# Altium project Handheld99.PrjPcb (part 1 of 3)
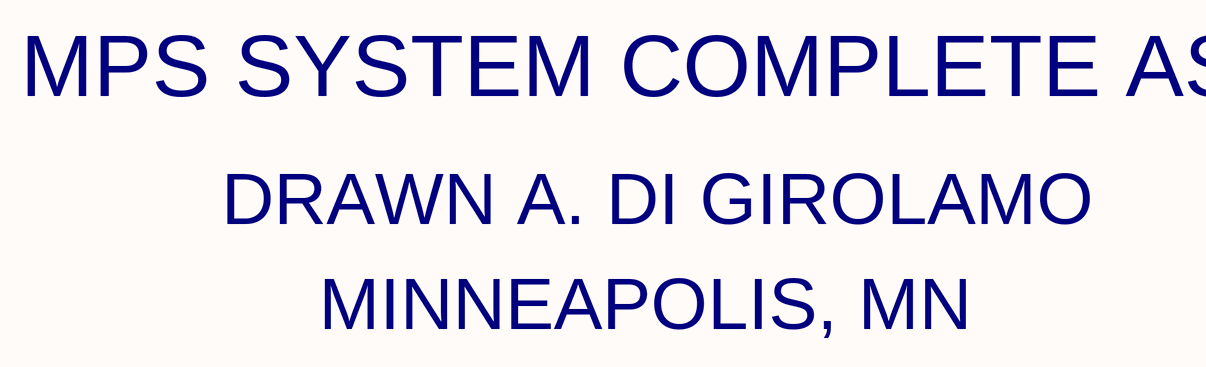
[diagram p0: title_sheet.SchDoc]
37 sheets, 508 parts. Net scope: hierarchical (ports join the sheet entries above them; power ports are global).
Board files: PCB_REAL2.PcbDoc, digital_placeholder.PcbDoc, Radio_batt_testboard.PcbDoc, March_PCBA.PcbDoc, January_PCBA.PcbDoc, January_PCBA _digital.PcbDoc
Sheets:
  title_sheet.SchDoc
  top_level.SchDoc
    MCU = mcu.SchDoc
    BUFF = buffer.SchDoc
    ADC = adc.SchDoc
    dcshift1 = dcshift_digital.SchDoc
    OPA5481 = voltagesource.SchDoc
    MECH = mechanical.SchDoc
    INA = ina.SchDoc
    HP = high_pass.SchDoc
    MIXER1 = mixer.SchDoc
    HP2 = high_pass.SchDoc
    AMP1 = amp.SchDoc
    DC1 = dcshift.SchDoc
    LP2 = LPF_ADC.SchDoc
    MIXER2 = mixer.SchDoc
    dcshift2 = dcshift_digital.SchDoc
    OPA5482 = voltagesource.SchDoc
    LO1 = LO.SchDoc
    LO2 = LO.SchDoc
    uBlox Radio = RADIO.SchDoc
    LO1_INA1 = LOINA.SchDoc
    LO1_INA2 = LOINA.SchDoc
    LO2_INA1 = LOINA.SchDoc
    LO2_INA2 = LOINA.SchDoc
    LP50Driver = 50Hz_GEN_LPF.SchDoc
    LPHFDriver = 5kHz_GEN_LPF.SchDoc
    LP = low_pass.SchDoc
    3v3_Regulator = 3v3_Regulator.SchDoc
    ADC_REF = ADC_Reference.SchDoc
    2v5_Regulator = 2v5_Regulator.SchDoc
    5v_Regulator = 5v_Regulator.SchDoc
    -5v_Regulator = -5v_Regulator.SchDoc
    Power_Input = Power_Input.SchDoc
    AMP2 = amp.SchDoc
    Batt_charger = Batt_Charger.SchDoc
    Large Relay 1 = Large_Relay.SchDoc
    Large Relay 2 = Large_Relay.SchDoc
    Small Relay 1 = Small_Relay.SchDoc
    Small Relay 2 = Small_Relay.SchDoc
    Negative DC-DC = 7419_SUPPLY.SchDoc
    Negative DC-DC = 7419_SUPPLY.SchDoc
    +24 Linear = 24V_Regulator.SchDoc
    5V Linear Digital = 5v_Reg_biggr.SchDoc
    -5V Linear Digital = -5v_Reg_biggr.SchDoc
    Large Relay 3 = Large_Relay.SchDoc
    ZIF_Bridge = ZIF_Bridge.SchDoc
    1v8_Regulator = 1v8_Regulator.SchDoc
    LO1_LPF = 5kHZ_LO_LPF.SchDoc
    LO1_HPF = 5kHZ_LO_LPF.SchDoc
    LO2_LPF = 600Hz_LO_LPF.SchDoc
    LO2_HPF = 5kHZ_LO_LPF.SchDoc

## Sheet title_sheet.SchDoc: TITLE SHEET
size A4; Organization: Altium Limited; Address1: L3, 12a Rodborough Rd; Address2: Frenchs Forest; Address3: NSW; Address4: Australia 2086; DocumentNumber: 1; Revision: 1

### Notes on the sheet
- MPS SYSTEM COMPLETE ASSY
- DRAWN A. DI GIROLAMO
- MINNEAPOLIS, MN
- Title
- Date:
- RE:
- Arturo di Girolamo
- Size:
- A3
- A

## Sheet top_level.SchDoc: TOP LEVEL
size A2; Organization: Altium Limited; Address1: L3, 12a Rodborough Rd; Address2: Frenchs Forest; Address3: NSW; Address4: Australia 2086; DocumentNumber: 1; Revision: 1
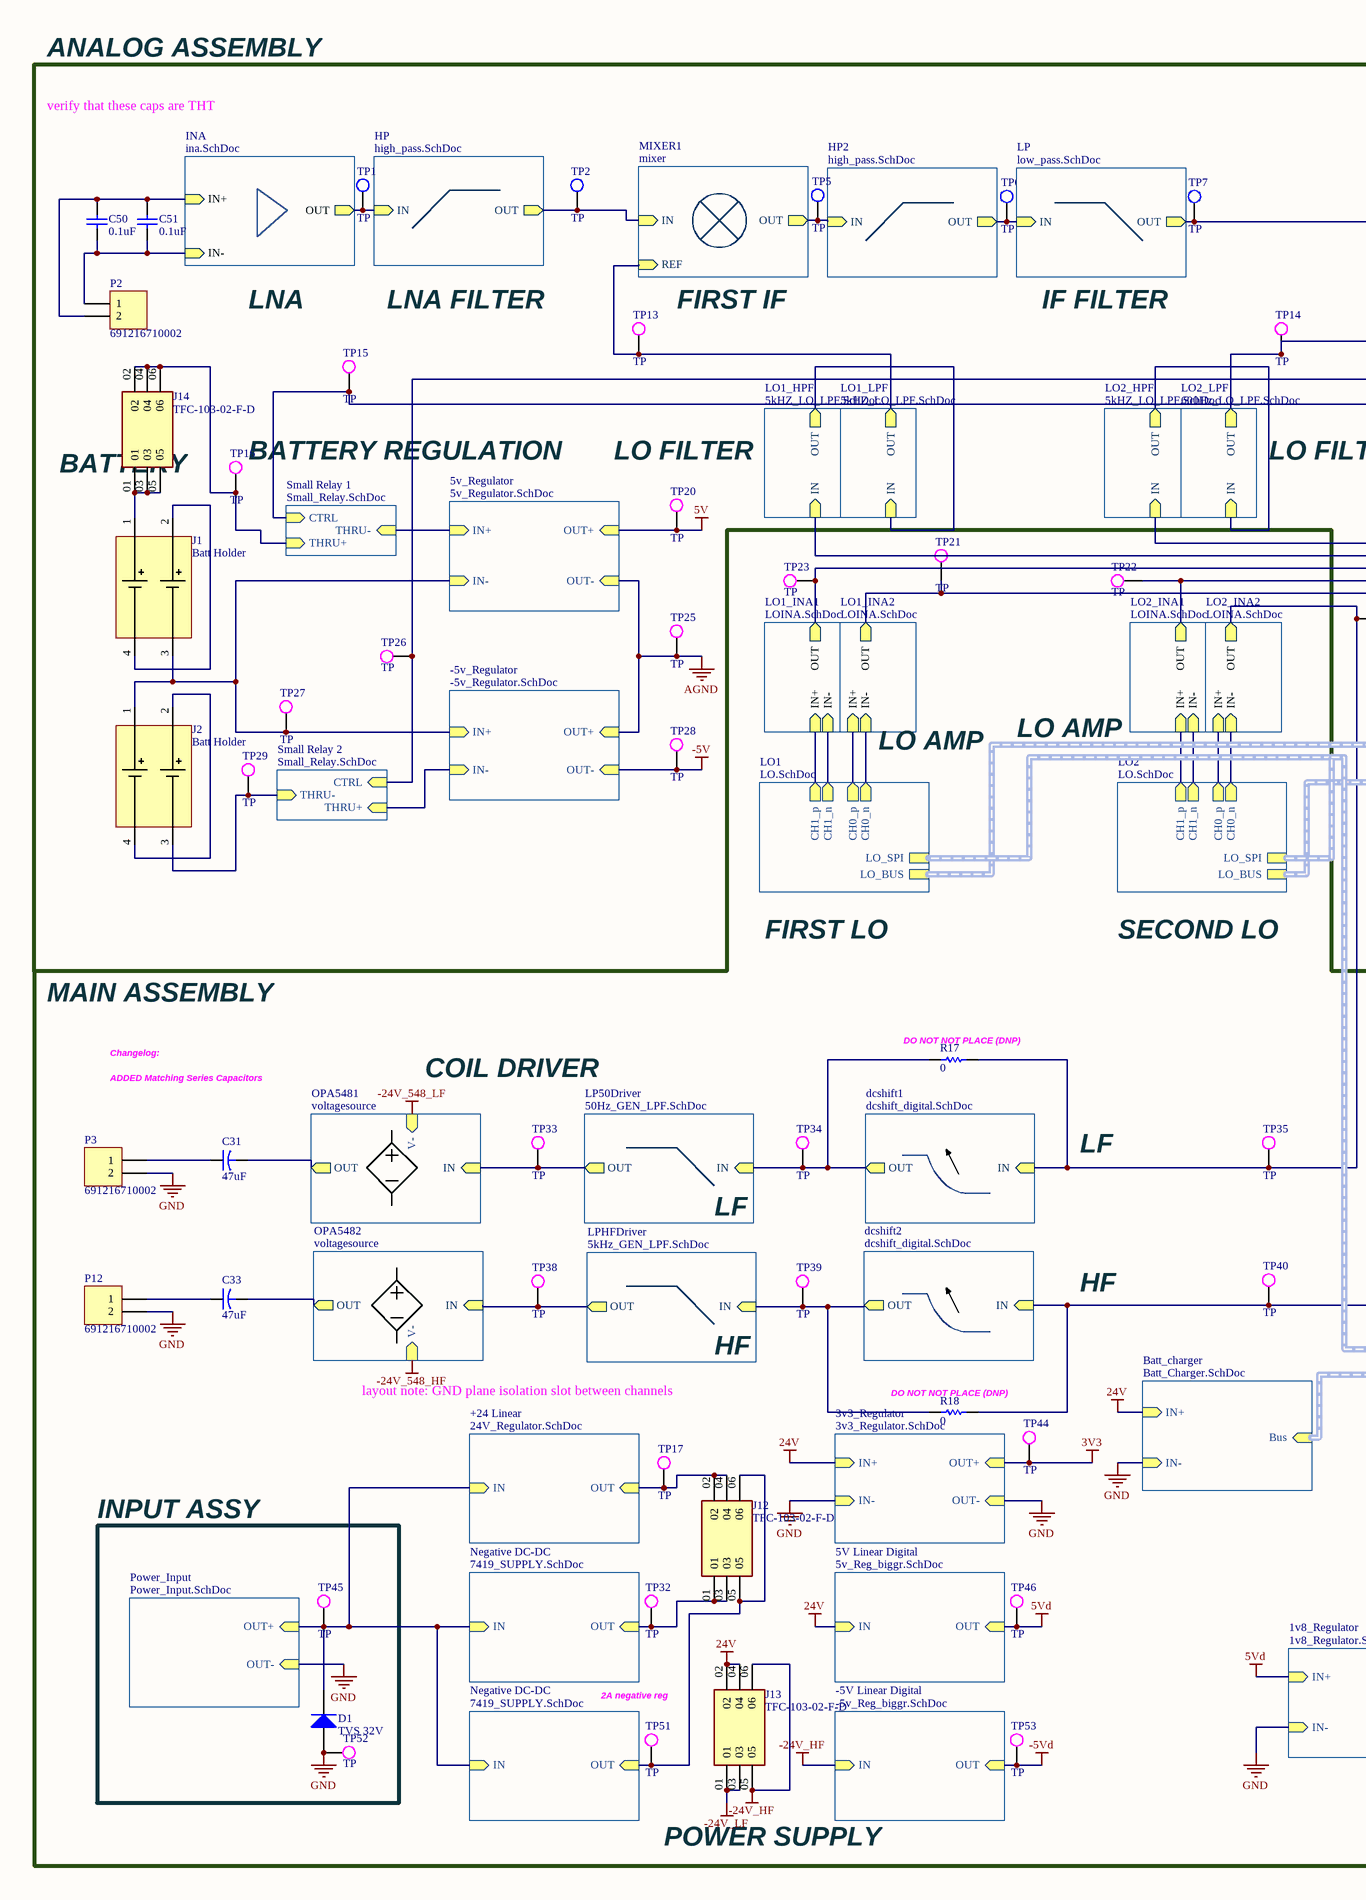
[diagram p1: top_level.SchDoc, left]
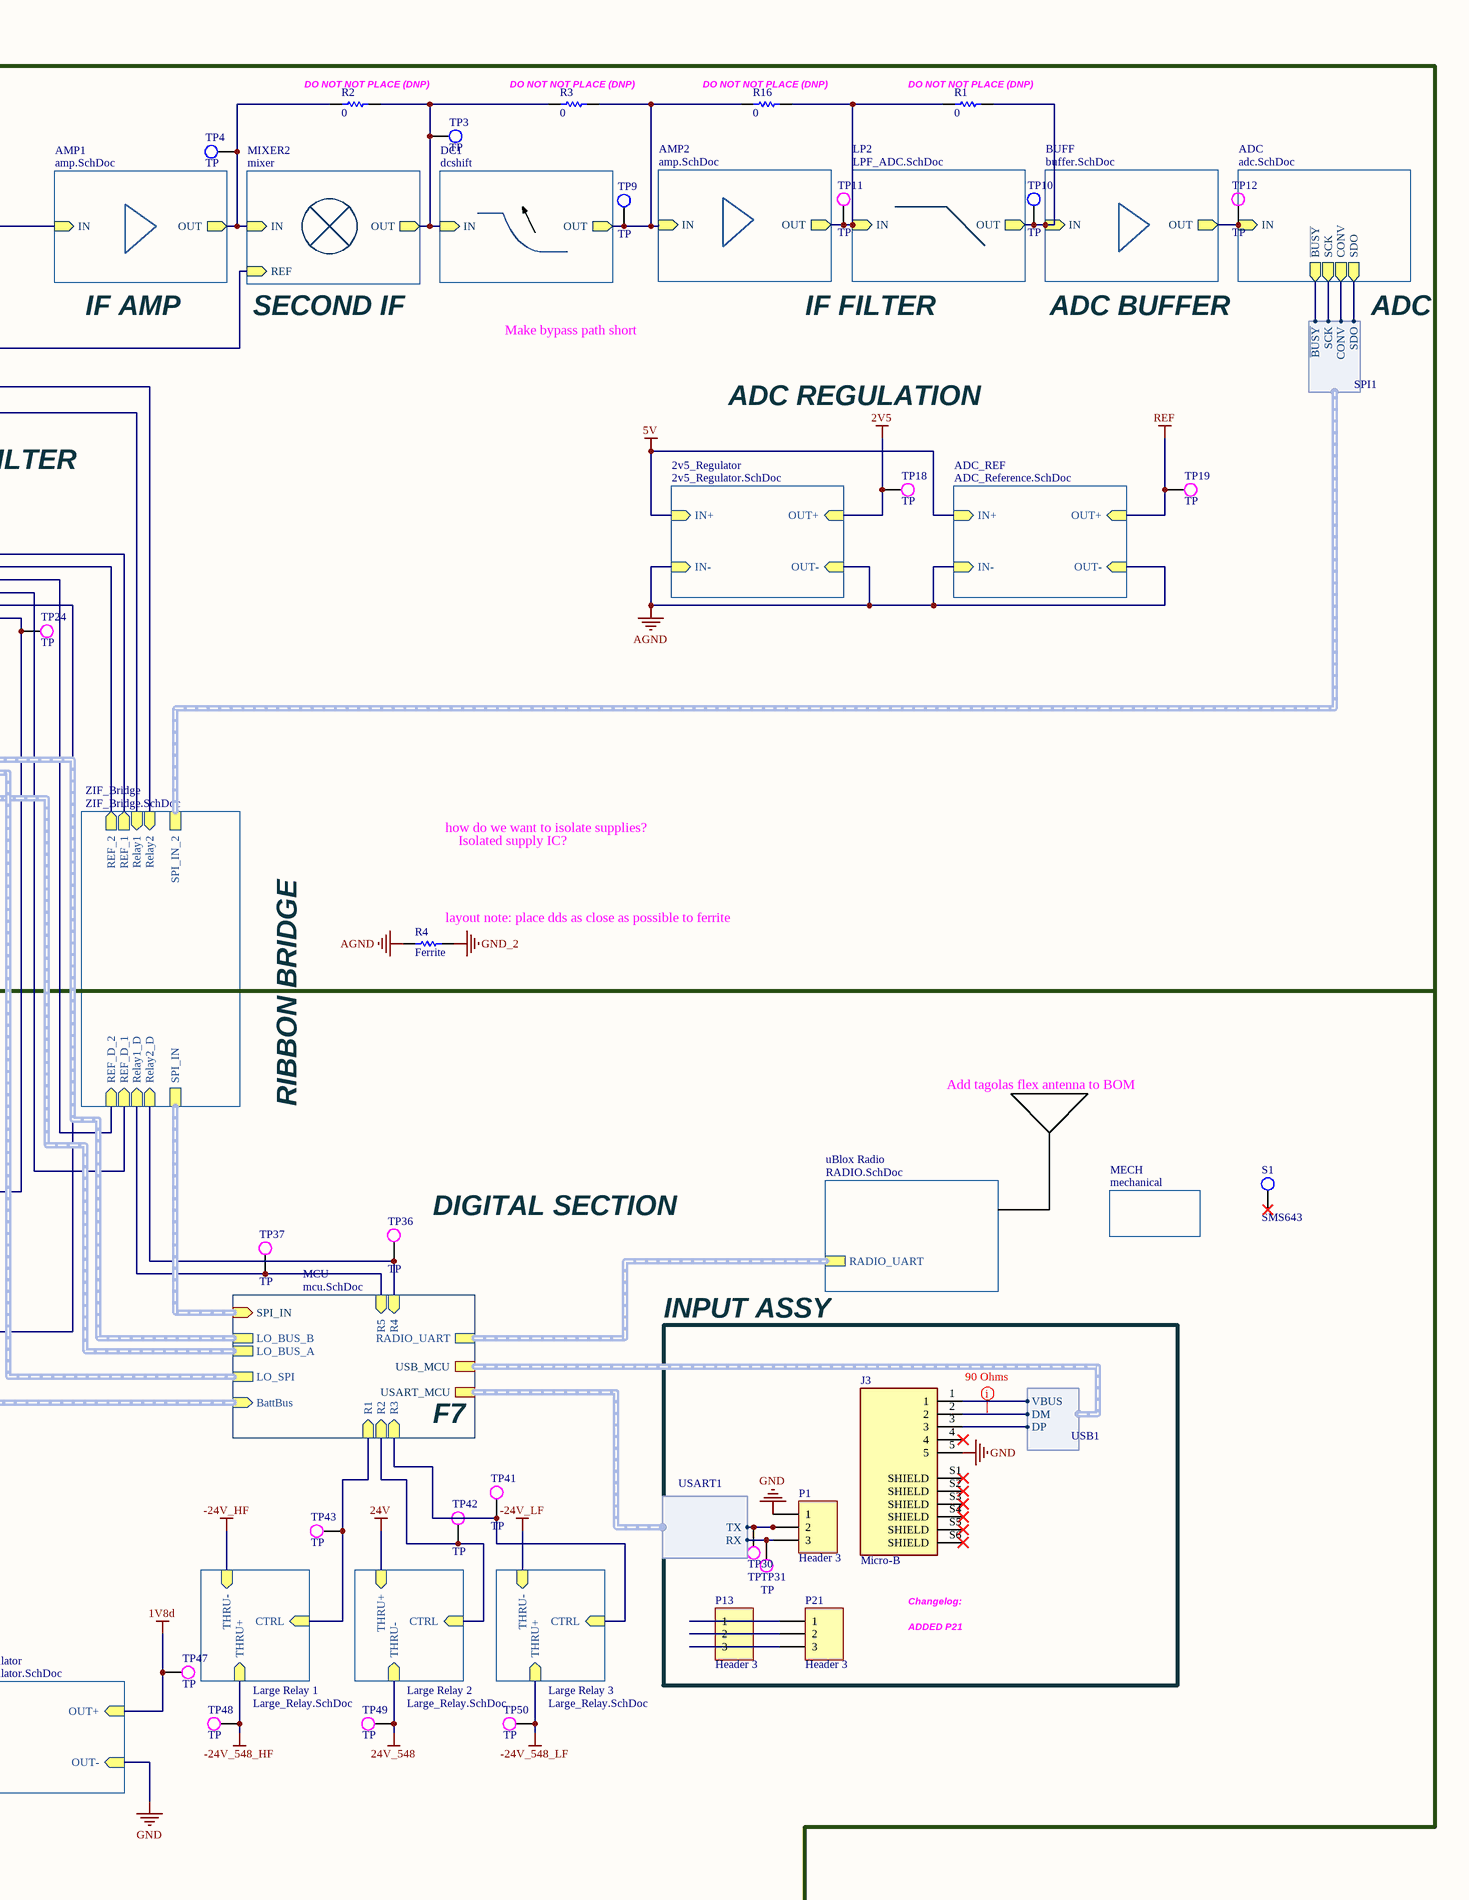
[diagram p2: top_level.SchDoc, right]

### Parts
C31  47uF  [R60xW]
C33  47uF  [10uF_THT_Ceramic]
C50  0.1uF  [STD_0805_C]
C51  0.1uF  [STD_0805_C]
D1  TVS 32V  [TVSDIODE-DO214AA]
J1  Batt Holder  [SMD_Batteryholder]
J2  Batt Holder  [SMD_Batteryholder]
J3  Micro-B  [10118194-0001LF]
J12  TFC-103-02-F-D  [SAMTEC_TFC-103-02-F-D]
J13  TFC-103-02-F-D  [SAMTEC_TFC-103-02-F-D]
J14  TFC-103-02-F-D  [SAMTEC_TFC-103-02-F-D]
P1  Header 3  [HDR1X3]
P2  691216710002  [HDR1X2]
P3  691216710002  [HDR1X2]
P12  691216710002  [HDR1X2]
P13  Header 3  [HDR1X3]
P21  Header 3  [HDR1X3]
R1  0  [0402_Res]
R2  0  [0402_Res]
R3  0  [0402_Res]
R4  Ferrite  [0402_Res]
R16  0  [0402_Res]
R17  0  [0402_Res]
R18  0  [0402_Res]
S1  SMS643  [SMS-463F]
TP1  TP  [Test_point]
TP2  TP  [Test_point]
TP3  TP  [Test_point]
TP4  TP  [Test_point]
TP5  TP  [Test_point]
TP6  TP  [Test_point]
TP7  TP  [Test_point]
TP9  TP  [Test_point]
TP10  TP  [Test_point]
TP11  TP  [Test_point]
TP12  TP  [Test_point]
TP13  TP  [Test_point]
TP14  TP  [Test_point]
TP15  TP  [Test_point]
TP16  TP  [Test_point]
TP17  TP  [Test_point]
TP18  TP  [Test_point]
TP19  TP  [Test_point]
TP20  TP  [Test_point]
TP21  TP  [Test_point]
TP22  TP  [Test_point]
TP23  TP  [Test_point]
TP24  TP  [Test_point]
TP25  TP  [Test_point]
TP26  TP  [Test_point]
TP27  TP  [Test_point]
TP28  TP  [Test_point]
TP29  TP  [Test_point]
TP30  TP  [Test_point]
TP31  TP  [Test_point]
TP32  TP  [Test_point]
TP33  TP  [Test_point]
TP34  TP  [Test_point]
TP35  TP  [Test_point]
TP36  TP  [Test_point]
TP37  TP  [Test_point]
TP38  TP  [Test_point]
TP39  TP  [Test_point]
TP40  TP  [Test_point]
TP41  TP  [Test_point]
TP42  TP  [Test_point]
TP43  TP  [Test_point]
TP44  TP  [Test_point]
TP45  TP  [Test_point]
TP46  TP  [Test_point]
TP47  TP  [Test_point]
TP48  TP  [Test_point]
TP49  TP  [Test_point]
TP50  TP  [Test_point]
TP51  TP  [Test_point]
TP52  TP  [Test_point]
TP53  TP  [Test_point]

### Blocks framed on the sheet
INPUT ASSY: J3 P1 P13 P21 TP30 TP31
INPUT ASSY: D1 TP45 TP52

### Sub-sheets
1v8_Regulator = 1v8_Regulator.SchDoc: IN+ (in), IN- (in), OUT+ (in), OUT- (in)
2v5_Regulator = 2v5_Regulator.SchDoc: IN+ (in), IN- (in), OUT+ (in), OUT- (in)
3v3_Regulator = 3v3_Regulator.SchDoc: IN+ (in), IN- (in), OUT+ (in), OUT- (in)
5V Linear Digital = 5v_Reg_biggr.SchDoc: IN (in), OUT (in)
5v_Regulator = 5v_Regulator.SchDoc: IN+ (in), IN- (in), OUT+ (in), OUT- (in)
+24 Linear = 24V_Regulator.SchDoc: IN (in), OUT (in)
-5V Linear Digital = -5v_Reg_biggr.SchDoc: IN (in), OUT (in)
-5v_Regulator = -5v_Regulator.SchDoc: IN+ (in), IN- (in), OUT+ (in), OUT- (in)
ADC = adc.SchDoc: IN (in), SDO (out), SCK (out), ~{BUSY} (out), CONV (out)
ADC_REF = ADC_Reference.SchDoc: IN+ (in), IN- (in), OUT+ (in), OUT- (in)
AMP1 = amp.SchDoc: IN (in), OUT (out)
AMP2 = amp.SchDoc: IN (in), OUT (out)
Batt_charger = Batt_Charger.SchDoc: IN+ (in), IN- (in), Bus (in, harness BattBus)
BUFF = buffer.SchDoc: IN (in), OUT (out)
DC1 = dcshift: IN (in), OUT (out)
dcshift1 = dcshift_digital.SchDoc: IN (in), OUT (out)
dcshift2 = dcshift_digital.SchDoc: IN (in), OUT (out)
HP = high_pass.SchDoc: IN (in), OUT (out)
HP2 = high_pass.SchDoc: IN (in), OUT (out)
INA = ina.SchDoc: IN+ (in), IN- (in), OUT (out)
Large Relay 1 = Large_Relay.SchDoc: CTRL (in), THRU+ (in), THRU- (in)
Large Relay 2 = Large_Relay.SchDoc: CTRL (in), THRU+ (in), THRU- (in)
Large Relay 3 = Large_Relay.SchDoc: CTRL (in), THRU+ (in), THRU- (in)
LO1 = LO.SchDoc: CH1_p (out), CH1_n (out), CH0_p (out), CH0_n (out), LO_BUS (harness LO_BUS), LO_SPI (harness LO_SPI)
LO1_HPF = 5kHZ_LO_LPF.SchDoc: IN (in), OUT (out)
LO1_INA1 = LOINA.SchDoc: IN+ (in), IN- (in), OUT (out)
LO1_INA2 = LOINA.SchDoc: IN+ (in), IN- (in), OUT (out)
LO1_LPF = 5kHZ_LO_LPF.SchDoc: IN (in), OUT (out)
LO2 = LO.SchDoc: CH1_p (out), CH1_n (out), CH0_n (out), CH0_p (out), LO_BUS (harness LO_BUS), LO_SPI (harness LO_SPI)
LO2_HPF = 5kHZ_LO_LPF.SchDoc: IN (in), OUT (out)
LO2_INA1 = LOINA.SchDoc: IN+ (in), IN- (in), OUT (out)
LO2_INA2 = LOINA.SchDoc: IN+ (in), IN- (in), OUT (out)
LO2_LPF = 600Hz_LO_LPF.SchDoc: IN (in), OUT (out)
LP = low_pass.SchDoc: IN (in), OUT (out)
LP2 = LPF_ADC.SchDoc: IN (in), OUT (out)
LP50Driver = 50Hz_GEN_LPF.SchDoc: IN (in), OUT (out)
LPHFDriver = 5kHz_GEN_LPF.SchDoc: IN (in), OUT (out)
MCU = mcu.SchDoc: USART_MCU (harness USART1), SPI_IN (in, harness SPI1), USB_MCU (harness USB1), LO_BUS_B (harness LO_BUS), LO_BUS_A (harness LO_BUS), RADIO_UART (harness RADIO_UART), LO_SPI (harness LO_SPI), BattBus (in, harness BattBus), R4 (in), R3 (in), R1 (in), R2 (in), R5 (in)
MECH = mechanical: no entries
MIXER1 = mixer: IN (in), OUT (out), REF (in)
MIXER2 = mixer: IN (in), OUT (out), REF (in)
Negative DC-DC = 7419_SUPPLY.SchDoc: IN (in), OUT (in)
Negative DC-DC = 7419_SUPPLY.SchDoc: IN (in), OUT (in)
OPA5481 = voltagesource: IN (in), OUT (out), V- (in)
OPA5482 = voltagesource: IN (in), OUT (out), V- (in)
Power_Input = Power_Input.SchDoc: OUT+ (in), OUT- (in)
Small Relay 1 = Small_Relay.SchDoc: CTRL (in), THRU+ (in), THRU- (in)
Small Relay 2 = Small_Relay.SchDoc: CTRL (in), THRU+ (in), THRU- (in)
uBlox Radio = RADIO.SchDoc: RADIO_UART (harness RADIO_UART)
ZIF_Bridge = ZIF_Bridge.SchDoc: SPI_IN_2 (harness SPI1), SPI_IN (harness SPI1), Relay1 (in), Relay2 (in), Relay1_D (in), Relay2_D (in), REF_D_1 (in), REF_2 (out), REF_D_2 (in), REF_1 (out)

### Harnesses
SPI1: ~{BUSY}, SCK, CONV, SDO
USB1: VBUS, DM, DP
USART1: TX, RX

### Nets
1V8d: TP47.1 ; sheet 1v8_Regulator/OUT+
2V5: TP18.1 ; sheet 2v5_Regulator/OUT+
3V3: TP44.1 ; sheet 3v3_Regulator/OUT+
5V: TP20.1 ; sheet ADC_REF/IN+, sheet 2v5_Regulator/IN+, sheet 5v_Regulator/OUT+
5Vd: TP46.1 ; sheet 5V Linear Digital/OUT, sheet 1v8_Regulator/IN+
24V: J13.02 J13.04 ; sheet 3v3_Regulator/IN+, sheet Batt_charger/IN+, sheet Large Relay 2/THRU+, sheet 5V Linear Digital/IN
24V_548: TP49.1 ; sheet Large Relay 2/THRU-
-5V: TP28.1 ; sheet -5v_Regulator/OUT-
-5Vd: TP53.1 ; sheet -5V Linear Digital/OUT
-24V_548_HF: TP48.1 ; sheet OPA5482/V-, sheet Large Relay 1/THRU+
-24V_548_LF: TP50.1 ; sheet OPA5481/V-, sheet Large Relay 3/THRU+
-24V_HF: J13.05 J13.06 ; sheet Large Relay 1/THRU-, sheet -5V Linear Digital/IN
-24V_LF: J13.01 J13.03 ; sheet Large Relay 3/THRU-
AGND: R4.1 TP25.1 ; sheet ADC_REF/IN-, sheet ADC_REF/OUT-, sheet 2v5_Regulator/IN-, sheet 2v5_Regulator/OUT-, sheet 5v_Regulator/OUT-, sheet -5v_Regulator/OUT+
GND: D1.1(A) J3.5 P1.1 P3.2 P12.2 TP52.1 ; sheet 3v3_Regulator/IN-, sheet 3v3_Regulator/OUT-, sheet Power_Input/OUT-, sheet Batt_charger/IN-, sheet 1v8_Regulator/IN-, sheet 1v8_Regulator/OUT-
GND_2: R4.2
REF: TP19.1 ; sheet ADC_REF/OUT+
USART1_RX: P1.3 TP31.1 ; sheet MCU/USART_MCU.RX
USART1_TX: P1.2 TP30.1 ; sheet MCU/USART_MCU.TX
NetC28_HP2_1: TP5.1 ; sheet MIXER1/OUT, sheet HP2/IN
NetC28_HP_1: TP1.1 ; sheet INA/OUT, sheet HP/IN
NetC31_1: C31.1 P3.1
NetC31_2: C31.2 ; sheet OPA5481/OUT
NetC33_1: C33.1 P12.1
NetC33_2: C33.2 ; sheet OPA5482/OUT
NetC38_2: TP7.1 ; sheet AMP1/IN, sheet LP/OUT
NetC50_1: C50.1 C51.1 P2.1 ; sheet INA/IN-
NetC50_2: C50.2 C51.2 P2.2 ; sheet INA/IN+
NetC93_1: sheet 5v_Regulator/IN+, sheet Small Relay 1/THRU-
NetC93_2: J1.3 J2.1 TP27.1 ; sheet 5v_Regulator/IN-, sheet -5v_Regulator/IN+
NetC96_1: sheet -5v_Regulator/IN-, sheet Small Relay 2/THRU+
NetC98_Negative_DC-DC#1_2: J12.01 J12.03 TP32.1 ; sheet Negative DC-DC/OUT
NetC98_Negative_DC-DC#2_2: J12.05 J12.06 TP51.1 ; sheet Negative DC-DC/OUT
NetC99_2: R1.2 TP10.1 ; sheet BUFF/IN, sheet LP2/OUT
NetC105_2: TP33.1 ; sheet OPA5481/IN, sheet LP50Driver/OUT
NetC111_2: TP38.1 ; sheet OPA5482/IN, sheet LPHFDriver/OUT
NetC117_LO1_HPF_2: sheet LO1_LPF/IN, sheet LO1_HPF/OUT
NetC117_LO1_LPF_2: TP13.1 ; sheet MIXER1/REF, sheet LO1_LPF/OUT
NetC117_LO2_HPF_2: sheet LO2_LPF/IN, sheet LO2_HPF/OUT
NetC123_2: TP14.1 ; sheet MIXER2/REF, sheet LO2_LPF/OUT
NetC130_Negative_DC-DC#1_2: D1.2(K) TP45.1 ; sheet Power_Input/OUT+, sheet Negative DC-DC/IN, sheet Negative DC-DC/IN, sheet +24 Linear/IN
NetC145_1: J12.02 J12.04 TP17.1 ; sheet +24 Linear/OUT
NetJ1_1: J1.1 J14.01 J14.03 J14.05
NetJ1_2: J1.2 J1.4
NetJ2_2: J2.2 J2.4
NetJ2_3: J2.3 TP29.1 ; sheet Small Relay 2/THRU-
NetJ3_1: J3.1 ; sheet MCU/USB_MCU.VBUS
NetJ3_2: J3.2 ; sheet MCU/USB_MCU.DM
NetJ3_3: J3.3 ; sheet MCU/USB_MCU.DP
NetJ5_07: TP23.1 ; sheet LO1_INA1/OUT, sheet ZIF_Bridge/REF_D_2
NetJ5_08: TP22.1 ; sheet LO2_INA1/OUT, sheet ZIF_Bridge/REF_D_1
NetJ5_09: TP36.1 ; sheet MCU/R4, sheet ZIF_Bridge/Relay2_D
NetJ5_10: TP37.1 ; sheet MCU/R5, sheet ZIF_Bridge/Relay1_D
NetJ9_01: TP15.1 ; sheet Small Relay 1/CTRL, sheet ZIF_Bridge/Relay1
NetJ9_02: TP26.1 ; sheet Small Relay 2/CTRL, sheet ZIF_Bridge/Relay2
NetJ9_03: sheet ZIF_Bridge/REF_1, sheet LO2_HPF/IN
NetJ9_04: sheet ZIF_Bridge/REF_2, sheet LO1_HPF/IN
NetJ9_05: sheet ADC/~{BUSY}, sheet ZIF_Bridge/SPI_IN_2.~{BUSY}
NetJ9_06: sheet ADC/SCK, sheet ZIF_Bridge/SPI_IN_2.SCK
NetJ9_07: sheet ADC/SDO, sheet ZIF_Bridge/SPI_IN_2.SDO
NetJ9_08: sheet ADC/CONV, sheet ZIF_Bridge/SPI_IN_2.CONV
NetJ14_02: J14.02 J14.04 J14.06 TP16.1 ; sheet Small Relay 1/THRU+
NetK1_Large_Relay_1_2: TP43.1 ; sheet MCU/R1, sheet Large Relay 1/CTRL
NetK1_Large_Relay_2_2: TP42.1 ; sheet MCU/R2, sheet Large Relay 2/CTRL
NetK1_Large_Relay_3_2: TP41.1 ; sheet MCU/R3, sheet Large Relay 3/CTRL
NetP13_1: P13.1 P21.1
NetP13_2: P13.2 P21.2
NetP13_3: P13.3 P21.3
NetR1_1: R1.1 R16.2 TP11.1 ; sheet LP2/IN, sheet AMP2/OUT
NetR2_1: R2.1 TP4.1 ; sheet AMP1/OUT, sheet MIXER2/IN
NetR2_2: R2.2 R3.1 TP3.1 ; sheet DC1/IN, sheet MIXER2/OUT
NetR3_2: R3.2 R16.1 TP9.1 ; sheet DC1/OUT, sheet AMP2/IN
NetR10_HP2_2: TP6.1 ; sheet HP2/OUT, sheet LP/IN
NetR10_HP_2: TP2.1 ; sheet HP/OUT, sheet MIXER1/IN
NetR17_1: R17.1 TP34.1 ; sheet dcshift1/OUT, sheet LP50Driver/IN
NetR17_2: R17.2 TP24.1 TP35.1 ; sheet dcshift1/IN, sheet LO2_INA2/OUT
NetR18_1: R18.1 TP39.1 ; sheet dcshift2/OUT, sheet LPHFDriver/IN
NetR18_2: R18.2 TP21.1 TP40.1 ; sheet dcshift2/IN, sheet LO1_INA2/OUT
NetR19_LO1_1: sheet LO1/CH0_p, sheet LO1_INA2/IN+
NetR19_LO2_1: sheet LO2/CH0_p, sheet LO2_INA2/IN+
NetR27_LO1_1: sheet LO1/CH0_n, sheet LO1_INA2/IN-
NetR27_LO2_1: sheet LO2/CH0_n, sheet LO2_INA2/IN-
NetR28_LO1_1: sheet LO1/CH1_p, sheet LO1_INA1/IN+
NetR28_LO2_1: sheet LO2/CH1_p, sheet LO2_INA1/IN+
NetR29_LO1_1: sheet LO1/CH1_n, sheet LO1_INA1/IN-
NetR29_LO2_1: sheet LO2/CH1_n, sheet LO2_INA1/IN-
NetR40_1: TP12.1 ; sheet BUFF/OUT, sheet ADC/IN

Not connected (* = marked no-connect by the designer): J3 4* S1(SHIELD)* S2(SHIELD)* S3(SHIELD)* S4(SHIELD)* S5(SHIELD)* S6(SHIELD)*; S1 1*

### Buses and harness runs
harness sheet Batt_charger/Bus = sheet MCU/BattBus
harness sheet LO1/LO_BUS = sheet MCU/LO_BUS_B
harness sheet LO1/LO_SPI = sheet LO2/LO_SPI = sheet MCU/LO_SPI
harness sheet LO2/LO_BUS = sheet MCU/LO_BUS_A
harness sheet MCU/RADIO_UART = sheet uBlox Radio/RADIO_UART
harness sheet MCU/SPI_IN = sheet ZIF_Bridge/SPI_IN

### Layout directives
mark named 90 Ohms: (no net found under the mark)

### Notes on the sheet
- ANALOG ASSEMBLY
- verify that these caps are THT
- (near R2) DO NOT NOT PLACE (DNP)
- (near R3) DO NOT NOT PLACE (DNP)
- (near R16) DO NOT NOT PLACE (DNP)
- (near R1) DO NOT NOT PLACE (DNP)
- LNA
- LNA FILTER
- (near TP13) FIRST IF
- IF FILTER
- IF AMP
- SECOND IF
- Make bypass path short
- ADC BUFFER
- ADC
- ADC REGULATION
- (near J14) BATTERY
- (near TP16) BATTERY REGULATION
- (near TP20) LO FILTER
- LO FILTER
- LO AMP
- how do we want to isolate supplies?
- Isolated supply IC?
- (near R4) layout note: place dds as close as possible to ferrite
- FIRST LO
- SECOND LO
- MAIN ASSEMBLY
- Changelog:
- (near R17) DO NOT NOT PLACE (DNP)
- ADDED Matching Series Capacitors
- COIL DRIVER
- RIBBON BRIDGE
- Add tagolas flex antenna to BOM
- LF
- (near TP36) DIGITAL SECTION
- HF
- layout note: GND plane isolation slot between channels
- (near R18) DO NOT NOT PLACE (DNP)
- F7
- ADDED P21
- 2A negative reg
- POWER SUPPLY
- Title
- Date:
- RE:
- Arturo di Girolamo
- Size:
- A2
- A

### Library data of the parts
C31 C33 = UCY2C470MPD: Capacitor, 47uF NICHICON; MFGPN: UCY2C470MPD
C50 C51 = CL21B104KACNNNC: Capacitor, 0.1uF, 0805; Value: .01uf; MFGPN: CL21B104KACNNNC
D1 = Diode: Default Diode; Published: 8-Jun-2000; LatestRevisionDate: 17-Jul-2002; LatestRevisionNote: Re-released for DXP Platform.; PackageVersion: Sep-1996; PackageReference: SMC; Publisher: Altium Limited; PackageDescription: DO-214-AB/SMC; 2 C-Bend Leads; Body 7.9 x 5.9 mm, inc. leads (LxW); Code_JEDEC: DO-214-AB
J1 J2 = 1048_Keystone_18650
J3 = 10118194-0001LF: USB - micro B USB 2.0 Receptacle Connector 5 Position Surface Mount, Right Angle; Through Hole; MFGPN: 10118194-0001LF
J12-J14 = TFC-103-02-F-D: MF: Samtec; Value: *; Availability: Unavailable; MP: TFC-103-02-F-D; Price: None; Package: None; ASYPN: TFC-103-02-F-D; ASYMFG: SAMTEC
P1 P13 P21 = Header 3: Header, 3-Pin; LatestRevisionDate: 17-Jul-2002; LatestRevisionNote: Re-released for DXP Platform.; Publisher: Altium Limited
P2 P3 P12 = Header 2: Header, 2-Pin; LatestRevisionDate: 17-Jul-2002; LatestRevisionNote: Re-released for DXP Platform.; Publisher: Altium Limited
R1-R3 R16-R18 = RMCF0805ZT0R00: 0 ohm jumper; Value: 0; ASYPN: RMCF0805ZT0R00
R4 = BMB2A0600AN4: Ferrite 0805; MFGPN: BMB2A0600AN4
TP1-TP7 TP9 TP10 = TP: Test Point
TP11-TP53 = TP_PCB: Test Point

## Sheet mcu.SchDoc: MCU
size A3; Organization: Altium Limited; Address1: L3, 12a Rodborough Rd; Address2: Frenchs Forest; Address3: NSW; Address4: Australia 2086
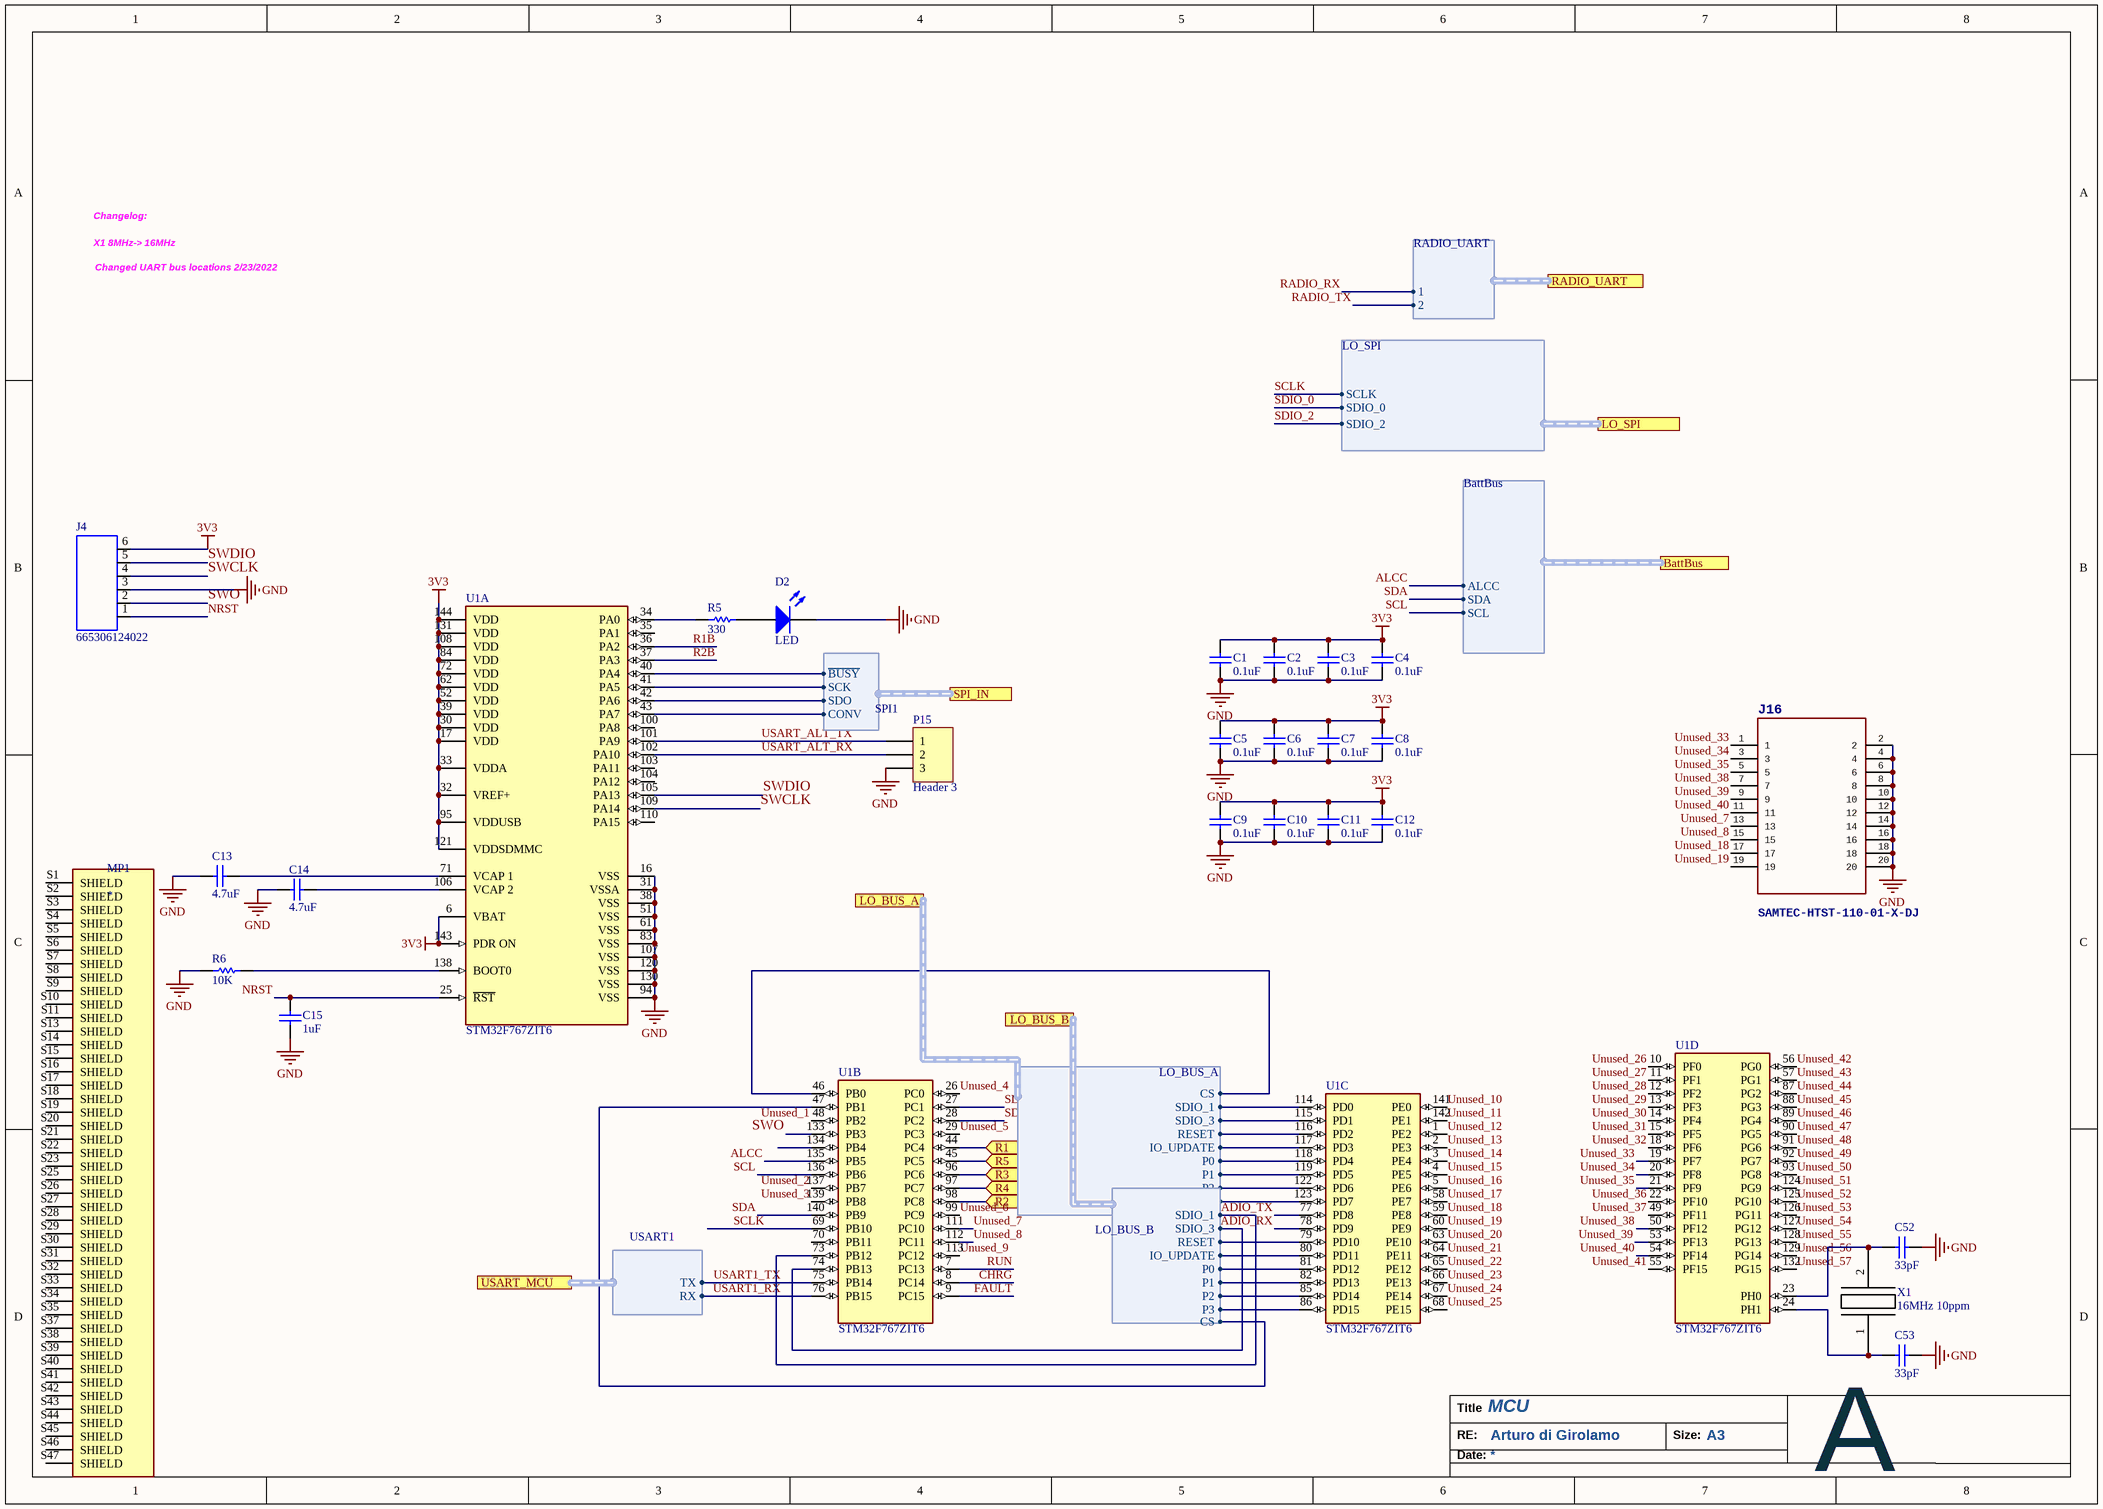
[diagram p3: mcu.SchDoc]

### Parts
C1  0.1uF  [0402_Cap]
C2  0.1uF  [0402_Cap]
C3  0.1uF  [0402_Cap]
C4  0.1uF  [0402_Cap]
C5  0.1uF  [0402_Cap]
C6  0.1uF  [0402_Cap]
C7  0.1uF  [0402_Cap]
C8  0.1uF  [0402_Cap]
C9  0.1uF  [0402_Cap]
C10  0.1uF  [0402_Cap]
C11  0.1uF  [0402_Cap]
C12  0.1uF  [0402_Cap]
C13  4.7uF  [0402_Cap]
C14  4.7uF  [0402_Cap]
C15  1uF  [0402_Cap]
C52  33pF  [0402_Cap]
C53  33pF  [0402_Cap]
D2  LED  [STD_LED]
J4  665306124022  [6pin_we]
J16  SAMTEC-HTST-110-01-X-DJ  [SAMTEC-HTST-110-01-X-D]
MP1  *  [WURTH_36103605S]
P15  Header 3  [HDR1X3]
R5  330  [0402_Res]
R6  10K  [0402_Res]
U1  STM32F767ZIT6  [FP-LQFP144-1A-MFG]  (parts A,B,C,D of 4)
X1  16MHz 10ppm  [XTAL_ECS-160-20-4X]

### Ports
BattBus (harness BattBus), LO_BUS_A (harness LO_BUS_A), LO_BUS_B (harness LO_BUS_B), LO_SPI (harness LO_SPI), R1 (in), R2 (in), R3 (in), R4 (in), R5 (in), RADIO_UART (harness RADIO_UART), SPI_IN (harness SPI1), USART_MCU (harness USART1)

### Harnesses
USART1: TX, RX
SPI1: ~{BUSY}, SCK, CONV, SDO
LO_BUS_A: P2, P1, P0, IO_UPDATE, RESET, SDIO_3, SDIO_1, P3, CS
LO_BUS_B: P2, P1, P0, IO_UPDATE, RESET, SDIO_3, SDIO_1, CS, P3
RADIO_UART: 1, 2
LO_SPI: SDIO_2, SDIO_0, SCLK
BattBus: ALCC, SDA, SCL

### Nets
3V3: C1.2 C2.2 C3.2 C4.2 C5.2 C6.2 C7.2 C8.2 C9.2 C10.2 C11.2 C12.2 J4.6 U1.6(VBAT) U1.17(VDD) U1.30(VDD) U1.32(VREF+) U1.33(VDDA) U1.39(VDD) U1.52(VDD) U1.62(VDD) U1.72(VDD) U1.84(VDD) U1.95(VDDUSB) U1.108(VDD) U1.121(VDDSDMMC) U1.131(VDD) U1.143(PDR_ON) U1.144(VDD)
GND: C1.1 C2.1 C3.1 C4.1 C5.1 C6.1 C7.1 C8.1 C9.1 C10.1 C11.1 C12.1 C13.1 C14.1 C15.1 C52.2 C53.2 D2.2 J4.3 J16.2 J16.4 J16.6 J16.8 J16.10 J16.12 J16.14 J16.16 J16.18 J16.20 P15.3 R6.1 U1.16(VSS) U1.31(VSSA) U1.38(VSS) U1.51(VSS) U1.61(VSS) U1.83(VSS) U1.94(VSS) U1.107(VSS) U1.120(VSS) U1.130(VSS)
ADC_CONV: U1.43(PA7) ; port SPI_IN.CONV
ADC_SCK: U1.41(PA5) ; port SPI_IN.SCK
ADC_SDO: U1.42(PA6) ; port SPI_IN.SDO
ALCC: U1.135(PB5) ; port BattBus.ALCC
~{BUSY}: U1.40(PA4) ; port SPI_IN.~{BUSY}
~{CS}: U1.46(PB0) ; port LO_BUS_A.CS
~{CS}: U1.47(PB1) ; port LO_BUS_B.CS  [a separate net that carries the same name]
CHRG: U1.8(PC14)
FAULT: U1.9(PC15)
IO_UPDATE: U1.117(PD3) ; port LO_BUS_A.IO_UPDATE
IO_UPDATE: U1.80(PD11) ; port LO_BUS_B.IO_UPDATE  [a separate net that carries the same name]
NRST: C15.2 J4.1 U1.25(~{RST})
P0: U1.118(PD4) ; port LO_BUS_A.P0
P0: U1.81(PD12) ; port LO_BUS_B.P0  [a separate net that carries the same name]
P1: U1.119(PD5) ; port LO_BUS_A.P1
P1: U1.82(PD13) ; port LO_BUS_B.P1  [a separate net that carries the same name]
P2: U1.122(PD6) ; port LO_BUS_A.P2
P2: U1.85(PD14) ; port LO_BUS_B.P2  [a separate net that carries the same name]
P3: U1.123(PD7) ; port LO_BUS_A.P3
P3: U1.86(PD15) ; port LO_BUS_B.P3  [a separate net that carries the same name]
R1B: U1.36(PA2)
R2B: U1.37(PA3)
RADIO_RX: U1.78(PD9) ; port RADIO_UART.1
RADIO_TX: U1.77(PD8) ; port RADIO_UART.2
RESET: U1.116(PD2) ; port LO_BUS_A.RESET
RESET: U1.79(PD10) ; port LO_BUS_B.RESET  [a separate net that carries the same name]
RUN: U1.7(PC13)
SCL: U1.136(PB6) ; port BattBus.SCL
SCLK: U1.69(PB10) ; port LO_SPI.SCLK
SDA: U1.140(PB9) ; port BattBus.SDA
SDIO_0: U1.27(PC1) ; port LO_SPI.SDIO_0
SDIO_1: U1.73(PB12) ; port LO_BUS_B.SDIO_1
SDIO_1: U1.114(PD0) ; port LO_BUS_A.SDIO_1  [a separate net that carries the same name]
SDIO_2: U1.28(PC2) ; port LO_SPI.SDIO_2
SDIO_3: U1.74(PB13) ; port LO_BUS_B.SDIO_3
SDIO_3: U1.115(PD1) ; port LO_BUS_A.SDIO_3  [a separate net that carries the same name]
SWCLK: J4.4 U1.109(PA14)
SWDIO: J4.5 U1.105(PA13)
SWO: J4.2 U1.133(PB3)
Unused_1: U1.48(PB2)
Unused_2: U1.137(PB7)
Unused_3: U1.139(PB8)
Unused_4: U1.26(PC0)
Unused_5: U1.29(PC3)
Unused_6: U1.99(PC9)
Unused_7: J16.13 U1.111(PC10)
Unused_8: J16.15 U1.112(PC11)
Unused_9: U1.113(PC12)
Unused_10: U1.141(PE0)
Unused_11: U1.142(PE1)
Unused_12: U1.1(PE2)
Unused_13: U1.2(PE3)
Unused_14: U1.3(PE4)
Unused_15: U1.4(PE5)
Unused_16: U1.5(PE6)
Unused_17: U1.58(PE7)
Unused_18: J16.17 U1.59(PE8)
Unused_19: J16.19 U1.60(PE9)
Unused_20: U1.63(PE10)
Unused_21: U1.64(PE11)
Unused_22: U1.65(PE12)
Unused_23: U1.66(PE13)
Unused_24: U1.67(PE14)
Unused_25: U1.68(PE15)
Unused_26: U1.10(PF0)
Unused_27: U1.11(PF1)
Unused_28: U1.12(PF2)
Unused_29: U1.13(PF3)
Unused_30: U1.14(PF4)
Unused_31: U1.15(PF5)
Unused_32: U1.18(PF6)
Unused_33: J16.1 U1.19(PF7)
Unused_34: J16.3 U1.20(PF8)
Unused_35: J16.5 U1.21(PF9)
Unused_36: U1.22(PF10)
Unused_37: U1.49(PF11)
Unused_38: J16.7 U1.50(PF12)
Unused_39: J16.9 U1.53(PF13)
Unused_40: J16.11 U1.54(PF14)
Unused_41: U1.55(PF15)
Unused_42: U1.56(PG0)
Unused_43: U1.57(PG1)
Unused_44: U1.87(PG2)
Unused_45: U1.88(PG3)
Unused_46: U1.89(PG4)
Unused_47: U1.90(PG5)
Unused_48: U1.91(PG6)
Unused_49: U1.92(PG7)
Unused_50: U1.93(PG8)
Unused_51: U1.124(PG9)
Unused_52: U1.125(PG10)
Unused_53: U1.126(PG11)
Unused_54: U1.127(PG12)
Unused_55: U1.128(PG13)
Unused_56: U1.129(PG14)
Unused_57: U1.132(PG15)
USART1_RX: U1.76(PB15) ; port USART_MCU.RX
USART1_TX: U1.75(PB14) ; port USART_MCU.TX
USART_ALT_RX: P15.2 U1.102(PA10)
USART_ALT_TX: P15.1 U1.101(PA9)
NetC13_2: C13.2 U1.71(VCAP_1)
NetC14_2: C14.2 U1.106(VCAP_2)
NetC52_1: C52.1 U1.23(PH0) X1.2
NetC53_1: C53.1 U1.24(PH1) X1.1
NetD2_1: D2.1 R5.2
NetJ5_09: U1.97(PC7) ; port R4
NetJ5_10: U1.45(PC5) ; port R5
NetK1_Large_Relay_1_2: U1.44(PC4) ; port R1
NetK1_Large_Relay_2_2: U1.98(PC8) ; port R2
NetK1_Large_Relay_3_2: U1.96(PC6) ; port R3
NetR5_1: R5.1 U1.34(PA0)
NetR6_2: R6.2 U1.138(BOOT0)

Not connected (* = marked no-connect by the designer): MP1 S1(SHIELD) S2(SHIELD) S3(SHIELD) S4(SHIELD) S5(SHIELD) S6(SHIELD) S7(SHIELD) S8(SHIELD) S9(SHIELD) S10(SHIELD) S11(SHIELD) S13(SHIELD) S14(SHIELD) S15(SHIELD) S16(SHIELD) S17(SHIELD) S18(SHIELD) S19(SHIELD) S20(SHIELD) S21(SHIELD) S22(SHIELD) S23(SHIELD) S25(SHIELD) S26(SHIELD) S27(SHIELD) S28(SHIELD) S29(SHIELD) S30(SHIELD) S31(SHIELD) S32(SHIELD) S33(SHIELD) S34(SHIELD) S35(SHIELD) S37(SHIELD) S38(SHIELD) S39(SHIELD) S40(SHIELD) S41(SHIELD) S42(SHIELD) S43(SHIELD) S44(SHIELD) S45(SHIELD) S46(SHIELD) S47(SHIELD); U1 35(PA1) 70(PB11) 100(PA8) 103(PA11) 104(PA12) 110(PA15) 134(PB4)

### Notes on the sheet
- Changelog:
- X1 8MHz-> 16MHz
- Changed UART bus locations 2/23/2022
- Title
- Date:
- RE:
- Arturo di Girolamo
- Size:
- A3
- A

### Library data of the parts
C1-C12 = CL21B104KACNNNC: Capacitor, 0.1uF, 0805; Value: .01uf; ASYPN: 0402YC104KAT2A; MFGPN: CL21B104KACNNNC; Parameter 1: *
C13 C14 = CL21A475KAQNNNE: Capacitor, 4.7uF, 0805; Value: .01uf; ASYPN: AMK105ABJ475MV-F; MFGPN: CL21A475KAQNNNE
C15 = CL21B105KBFNFNE: Capacitor, 1uF, 0805; Value: .01uf; ASYPN: CGB2A3JB0G105M033BB; MFGPN: CL21B105KBFNFNE
C52 C53 = CC0805GRNPO9BN330: Capacitor, 33pF, 0805; Value: .01uf; ASYPN: 04025C330JAT2A; MFGPN: CC0805GRNPO9BN330
D2 = LNJ037X8ARA: Typical LED; ASYPN: LO R976-PS-1; MFGPN: LNJ037X8ARA
J4 = 6pin_WE: Connector Header Surface Mount 6 position 0.039 (1.00mm); MF: WÃ¼rth Elektronik; Check_prices: https://www.snapeda.com/parts/665306124022/W%C3%BCrth%20Elektronik/view-part/1276936/?ref=eda; Price: None; Value: *; Availability: Warning; Package: None; Purchase-URL: https://pricing.snapeda.com/search/part/665306124022/?ref=eda; MP: 665306124022; SnapEDA_Link: https://www.snapeda.com/parts/665306124022/W%C3%BCrth%20Elektronik/view-part/1276936/?ref=snap; ASYPN: 665306124022
J16 = SAMTEC-HTST-110-01-X-DJ: GateName_1: A; SymbolName_1: SAMTEC-HTST-110-01-X-DA; DeviceName: J; LibraryName: SAMTEC-HTST-110-01-X-D; DeviceSetName: SAMTEC-HTST-110-01-X-D; Package: SAMTEC-HTST-110-01-X-D
MP1 = 36103605S: RF SHIELD 2.362" SURFACE MOUNT; Package: None; Price: None; Value: *; MP: 36103605S; Availability: Unavailable; ASYPN: 36103605S
P15 = Header 3: Header, 3-Pin; LatestRevisionDate: 17-Jul-2002; LatestRevisionNote: Re-released for DXP Platform.; Publisher: Altium Limited
R5 = RL1220S-R33-F: 330 1% 1/3W; Value: 1K; ASYPN: RC0402JR-07330RL; MFGPN: RL1220S-R33-F
R6 = RNCP0805FTD10K0: 10K 1% 1/4W; Value: 1K; ASYPN: RMCF0402FT10K0; MFGPN: RNCP0805FTD10K0
U1 = CMP-12105-000074-1: IC MCU 32BIT 2MB FLASH 144LQFP; Manufacturer: STMicroelectronics; Ram Size: 512KBytes; Number Of I/Os: 114; Core Architecture: ARM Cortex-M7; Memory Size: 2048KBytes; Standoff Height: 0.05mm; Number Of Adc Channels: 24; Max Supply Voltage: 3.6V; Number Of Pwm Channels: 4; Min Supply Voltage: 1.7V; Max Junction Temp: +105°C; Number Of Timers/Counters: 15; Number Of Usb Channels: 1; Interface: I2C,SPI,UART,USART,EBI/EMI,CAN,USB,LIN,IrDA,Ethernet,I2S; Frequency: 216MHz; Data Bus Width: 32bits; Number Of Spi Channels: 6; Number Of A/D Converters: 3; Octopart: https://octopart.com/stm32f767zit6-stmicroelectronics-70527068; Category: IC; Device Class L2: Embedded Processors and Controllers; Package: LQFP144-1A; RoHS: TRUE; Digikey Description: IC MCU 32BIT 2MB FLASH 144LQFP; ComponentLink2Description: Datasheet; Automotive: No; Mouser Description: ARM Microcontrollers - MCU High-performance and DSP with FPU, ARM Cortex-M7 MCU with 2 Mbytes Flash, 216 MHz CPU, Art Accelerator, L1 cache, SDRAM,; Ambient Temperature Range Low: -40°C; Ambient Temperature Range High: +85°C; Memory Type: FLASH; ComponentLink2URL: https://www.st.com/resource/en/datasheet/stm32f767zi.pdf; Number Of Uart Channels: 4; Temperature: -40°C to +85°C; Device Class L3: Microcontrollers; Device Class L1: Integrated Circuits (ICs); Temperature Range Low: -40°C; Temperature Range High: +85°C; Lead Free: Yes; Number Of I2C Channels: 4; Number Of Ethernet Channels: 1; Height: 1.6mm; Number Of Cores: 1; Manufacturer Part Number: STM32F767ZIT6; Ipc Land Pattern Name: QFP50P2200X2200X160-144; ASYPN: STM32F767ZIT6
X1 = 9B-8.000MEEJ-B

## Sheet buffer.SchDoc: ADC BUFFER
size A4; Organization: Altium Limited; Address1: L3, 12a Rodborough Rd; Address2: Frenchs Forest; Address3: NSW; Address4: Australia 2086; DocumentNumber: 1; Revision: 1
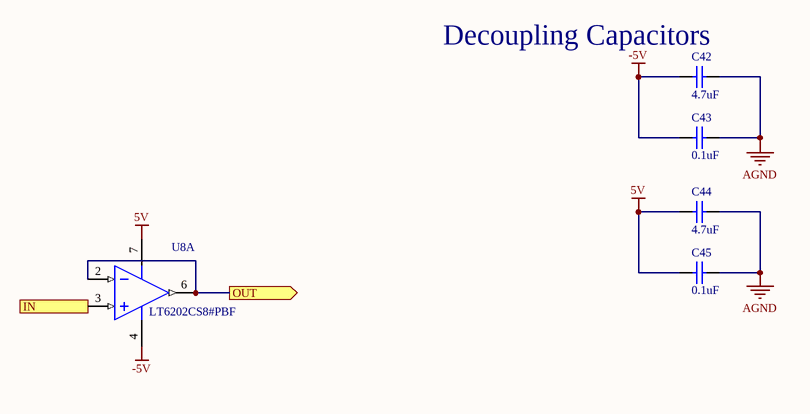
[diagram p4: buffer.SchDoc]

### Parts
C42  4.7uF  [0402_Cap]
C43  0.1uF  [0402_Cap]
C44  4.7uF  [0402_Cap]
C45  0.1uF  [0402_Cap]
U8  LT6202CS8#PBF  [LT-S8-8_N]  (part A of 2)

### Ports
IN (in), OUT (out)

### Nets
5V: C44.1 C45.1 U8.7(V+)
-5V: C42.1 C43.1 U8.4(V-)
AGND: C42.2 C43.2 C44.2 C45.2
NetC99_2: U8.3(+IN) ; port IN
NetR40_1: U8.2(-IN) U8.6(OUT) ; port OUT

### Notes on the sheet
- (near C42) Decoupling Capacitors
- Title
- Date:
- RE:
- Arturo di Girolamo
- Size:
- A3
- A

### Library data of the parts
C42 C44 = CL21A475KAQNNNE: Capacitor, 4.7uF, 0805; Value: .01uf; ASYPN: GRM155R61A475MEAAD; MFGPN: CL21A475KAQNNNE
C43 C45 = CL21B104KACNNNC: as C1 on sheet mcu; MFGPN: CL21B104KACNNNC
U8 = CMP-0359-02644-2: Single Channel, Low Noise, High Speed Operational Amplifier, RRIO, 100 MHz Typical GBW, 25 V/us Typical SR, 2.5 to 12.6 V, 8-Pin SOIC (S8-8), Commercial, Pb-Free; Linear Technology Part Number: LT6202; Manufacturer: Linear Technology; Channels (#): 1; Vs Min (V): 2.5; Is (mA) Typical: 2.8; Vos (mV) Typical: 0.1; Vos (mV) Guaranteed: 0.5; GBW (MHz) Typical: 100; Vs Max (V): 12.6; SR (V/us) Typical: 25; RevisionNote: URLs updated; ComponentLink2URL: http://cds.linear.com/docs/en/datasheet/620234fd.pdf; PackageDescription: 8-Pin Plastic Small Outline, Body 4.9 x 3.9 mm, Pitch 1.27 mm; RoHS: Pb-Free; ComponentLink3Description: Package Specification; ComponentLink2Description: Datasheet; PackageVersion: Rev G; ComponentLink3URL: http://cds.linear.com/docs/en/packaging/05081610_G_SO8.pdf; ComponentLink1Description: Manufacturer URL; DatasheetVersion: Rev. D; PackageReference: LT-S8-8; Mounting Technology: Surface Mount; ComponentLink1URL: http://www.linear.com/; Type: VFB; PartNumber: LT6202CS8#PBF; ASYPN: LT6202CS8#PBF

## Sheet adc.SchDoc: ADC
size A4; Organization: Altium Limited; Address1: L3, 12a Rodborough Rd; Address2: Frenchs Forest; Address3: NSW; Address4: Australia 2086; DocumentNumber: 1; Revision: 1
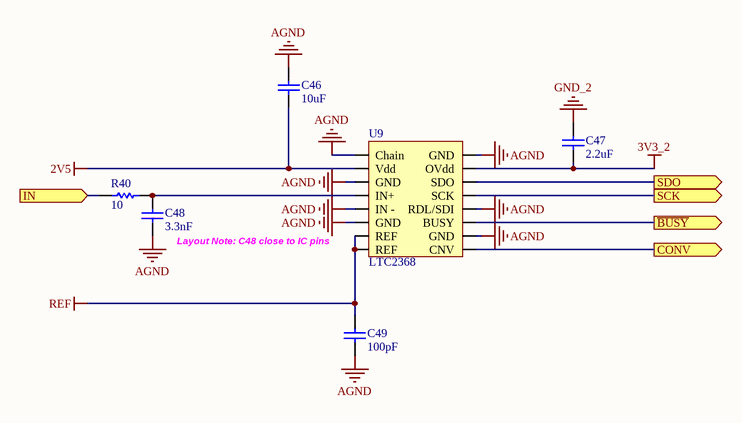
[diagram p5: adc.SchDoc]

### Parts
C46  10uF  [0402_Cap]
C47  2.2uF  [0402_Cap]
C48  3.3nF  [0402_Cap]
C49  100pF  [STD_0805_C]
R40  10  [0402_Res]
U9  LTC2368  [MSOP_16]

### Ports
CONV (out), IN (in), SCK (out), SDO (out), ~{BUSY} (out)

### Nets
2V5: C46.1 U9.2(Vdd)
3V3_2: C47.1 U9.15(OVdd)
AGND: C46.2 C48.1 C49.1 U9.1(Chain) U9.3(GND) U9.5(IN_-) U9.6(GND) U9.10(GND) U9.12(RDL/SDI) U9.16(GND)
GND_2: C47.2
REF: C49.2 U9.7(REF) U9.8(REF)
NetC48_2: C48.2 R40.2 U9.4(IN+)
NetJ9_05: U9.11(BUSY) ; port ~{BUSY}
NetJ9_06: U9.13(SCK) ; port SCK
NetJ9_07: U9.14(SDO) ; port SDO
NetJ9_08: U9.9(CNV) ; port CONV
NetR40_1: R40.1 ; port IN

### Notes on the sheet
- Layout Note: C48 close to IC pins
- Title
- Date:
- RE:
- Arturo di Girolamo
- Size:
- A3
- A

### Library data of the parts
C46 = CL21A106KAFN3NE: Capacitor, 10uF, 0805; Value: .01uf; ASYPN: CL05A106MQ5NUNC; MFGPN: CL21A106KAFN3NE
C47 = CL21A225KAFNNNE: Capacitor, 2.2uF, 0805; Value: .01uf; ASYPN: CL05A225KP5NNNC; MFGPN: CL21A225KAFNNNE
C48 = C0805C332KARACAUTO: Capacitor, 3.3nF, 0805; Value: .01uf; ASYPN: GRM1557U1A332JA01D; MFGPN: C0805C332KARACAUTO
C49 = CL21C101JCANNNC: Capacitor, 100pF, 0805; Value: .01uf; ASYPN: 885012205001; MFGPN: CL21C101JCANNNC
R40 = RNCF0805DTE10R0: 10 ohm 0805; ASYPN: PFR05S-100-FNH; Value: 10; MFGPN: RNCF0805DTE10R0
U9 = LTC2368: ASYPN: LTC2368IMS-24#PBF

## Sheet dcshift_digital.SchDoc: Digital DC Shift
size A4; Organization: Altium Limited; Address1: L3, 12a Rodborough Rd; Address2: Frenchs Forest; Address3: NSW; Address4: Australia 2086
Used 2 times, as channels dcshift1, dcshift2. Parts and nets are listed once, with the designators drawn on the sheet.
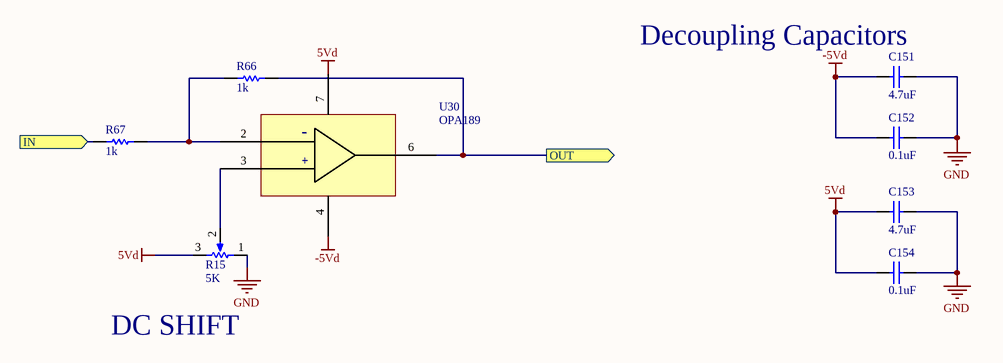
[diagram p6: dcshift_digital.SchDoc]

### Parts
C151  4.7uF  [0402_Cap]
C152  0.1uF  [0402_Cap]
C153  4.7uF  [0402_Cap]
C154  0.1uF  [0402_Cap]
R15  5K  [TRIMPOT]
R66  1k  [0402_Res]
R67  1k  [0402_Res]
U30  OPA189  [SOIC_8]

### Ports
IN (in), OUT (out)

### Nets
5Vd: C153.1 C154.1 R15.3(BOT) U30.7
-5Vd: C151.1 C152.1 U30.4
GND: C151.2 C152.2 C153.2 C154.2 R15.1(TOP)
IN: R67.1 ; port IN
OUT: R66.2 U30.6 ; port OUT
NetR15_2: R15.2(TAP) U30.3
NetR66_1: R66.1 R67.2 U30.2

### Channels
dcshift1: designators end in _dcshift1; ports IN=NetR17_2 OUT=NetR17_1
dcshift2: designators end in _dcshift2; ports IN=NetR18_2 OUT=NetR18_1

### Notes on the sheet
- (near C151) Decoupling Capacitors
- DC SHIFT
- Title
- Date:
- RE:
- Arturo di Girolamo
- Size:
- A3
- A
- (in symbol OPA189IDR) -; +

### Library data of the parts
C151 C153 = CL21A475KAQNNNE: as C42 on sheet buffer; MFGPN: CL21A475KAQNNNE
C152 C154 = CL21B104KACNNNC: as C1 on sheet mcu; MFGPN: CL21B104KACNNNC
R15 = PV36W102C01B00: Potentiometer, 1k; MFGPN: PV36W102C01B00
R66 R67 = RNCP0805FTD1K00: 1K 1% 1/4W; ASYPN: RMCF0402FT1K00; Value: 1K; MFGPN: RNCP0805FTD1K00
U30 = OPA189IDR: Precision OpAmp, Generic; MFGPN: OPA189IDR; ASYPN: OPA189ID

## Sheet voltagesource.SchDoc: 548 Voltage source
size A4; Organization: Altium Limited; Address1: L3, 12a Rodborough Rd; Address2: Frenchs Forest; Address3: NSW; Address4: Australia 2086
Used 2 times, as channels OPA5481, OPA5482. Parts and nets are listed once, with the designators drawn on the sheet.
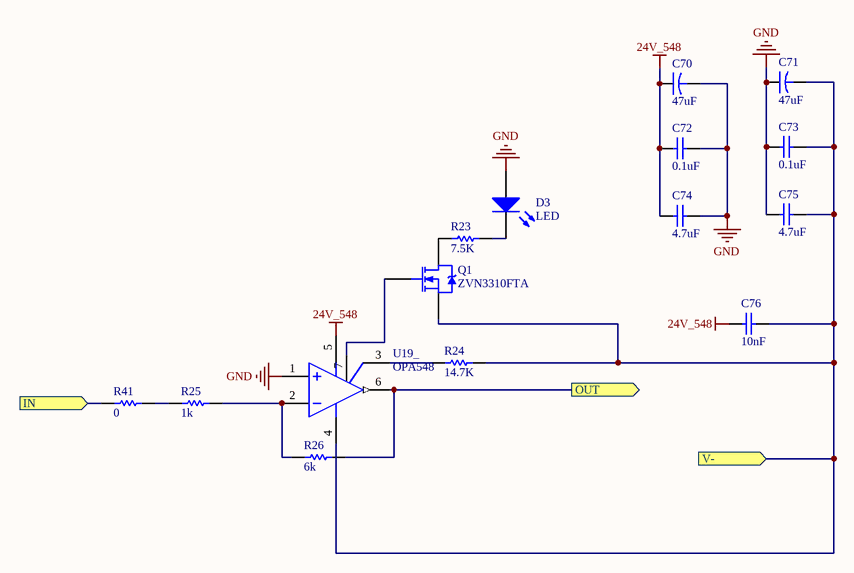
[diagram p7: voltagesource.SchDoc]

### Parts
C70  47uF  [bigcap]
C71  47uF  [bigcap]
C72  0.1uF  [0402_Cap]
C73  0.1uF  [0402_Cap]
C74  4.7uF  [0402_Cap]
C75  4.7uF  [0402_Cap]
C76  10nF  [0402_Cap]
D3  LED  [STD_LED]
Q1  ZVN3310FTA  [SOT-23B_M]
R23  7.5K  [0402_Res]
R24  14.7K  [0402_Res]
R25  1k  [0402_Res]
R26  6k  [0402_Res]
R41  0  [0402_Res]
U19_  OPA548  [TO-220-7]

### Ports
IN (in), OUT (out), V- (in)

### Nets
24V_548: C70.1 C72.1 C74.1 C76.1 U19_.5(V+)
GND: C70.2 C71.1 C72.2 C73.1 C74.2 C75.1 D3.1 U19_.1(IN-)
IN: R41.1 ; port IN
OUT: R26.2 U19_.6(OUT) ; port OUT
V-: C71.2 C73.2 C75.2 C76.2 Q1.3(S) R24.2 U19_.4(V-) ; port V-
NetD3_2: D3.2 R23.2
NetQ1_1: Q1.1(G) U19_.7(OS_NUL)
NetQ1_2: Q1.2(D) R23.1
NetR24_1: R24.1 U19_.3(TAB)
NetR25_1: R25.1 R41.2
NetR25_2: R25.2 R26.1 U19_.2(IN+)

### Channels
OPA5481: designators end in _OPA5481; ports IN=NetC105_2 OUT=NetC31_2 V-=-24V_548_LF
OPA5482: designators end in _OPA5482; ports IN=NetC111_2 OUT=NetC33_2 V-=-24V_548_HF

### Notes on the sheet
- Title
- Date:
- RE:
- Arturo di Girolamo
- Size:
- A3
- A

### Library data of the parts
C70 C71 = UCY2C470MPD: Capacitor, 47uF NICHICON; MFGPN: UCY2C470MPD
C72 C73 = CL21B104KACNNNC: Capacitor, 0.1uF, 0805; Value: .01uf; ASYPN: GMK105BJ104KV-F; MFGPN: CL21B104KACNNNC
C74 C75 = CL21A475KAQNNNE: Capacitor, 4.7uF, 0805; Value: .01uf; ASYPN: C1005X5R1V105K050BC; MFGPN: CL21A475KAQNNNE
C76 = C0805C103K1RAC7210: Capacitor, 10nF, 0805; Value: .01uf; ASYPN: C1005X7S2A103K050BB; MFGPN: C0805C103K1RAC7210
D3 = LNJ037X8ARA: Typical LED; MFGPN: LNJ037X8ARA
Q1 = ZVN3310FTA: N-Channel Power MOSFET; ComponentLink1Description: Manufacturer Link; ComponentLink1URL: http://www.irf.com/; MFGPN: ZVN3310FTA
R23 = ERJ-PB6D7501V: 7.5K 1% 1/4W; Value: 1K; MFGPN: ERJ-PB6D7501V
R24 = RC0805FR-0714K7L: 14.7K 1% 1/4W; Value: 1K; ASYPN: ERJ-2RKF1472X; MFGPN: RC0805FR-0714K7L
R25 = RNCP0805FTD1K00: 1K 1% 1/4W; ASYPN: RMCF0402FT1K00; Value: 1K; MFGPN: RNCP0805FTD1K00
R26 = RMCF0805FT5K60: 6K 1% 1/4W; ASYPN: RMCF0402FT5K90; Value: 6k; MFGPN: RMCF0805FT5K60
R41 = RMCF0805ZT0R00: 0 ohm jumper; Value: 0; MFGPN: RMCF0805ZT0R00; ASYPN: RMCF0805ZT0R00
U19_ = OPA548T: High power op amp; MFGPN: OPA548T

## Sheet mechanical.SchDoc: Mechanical
size A4; Organization: Altium Limited; Address1: L3, 12a Rodborough Rd; Address2: Frenchs Forest; Address3: NSW; Address4: Australia 2086
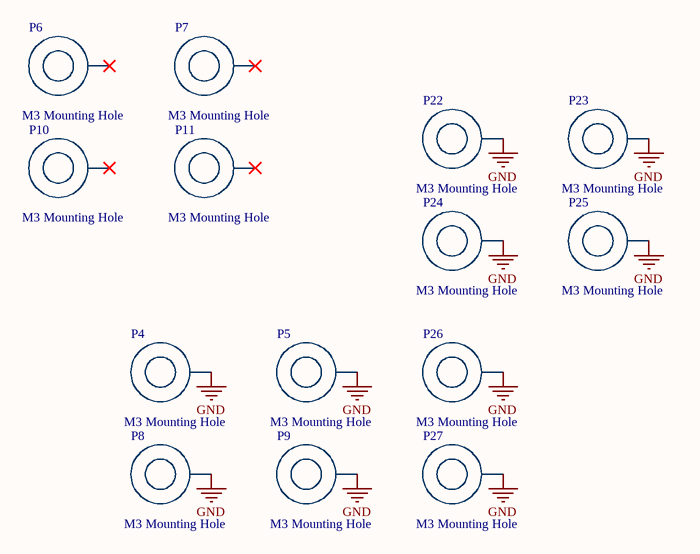
[diagram p8: mechanical.SchDoc]

### Parts
P4  M3 Mounting Hole  [MH-M3]
P5  M3 Mounting Hole  [MH-M3]
P6  M3 Mounting Hole  [MH-M3]
P7  M3 Mounting Hole  [MH-M3]
P8  M3 Mounting Hole  [MH-M3]
P9  M3 Mounting Hole  [MH-M3]
P10  M3 Mounting Hole  [MH-M3]
P11  M3 Mounting Hole  [MH-M3]
P22  M3 Mounting Hole  [MH-M3]
P23  M3 Mounting Hole  [MH-M3]
P24  M3 Mounting Hole  [MH-M3]
P25  M3 Mounting Hole  [MH-M3]
P26  M3 Mounting Hole  [MH-M3]
P27  M3 Mounting Hole  [MH-M3]

### Nets
GND: P4.1 P5.1 P8.1 P9.1 P22.1 P23.1 P24.1 P25.1 P26.1 P27.1

Not connected (* = marked no-connect by the designer): P6 1*; P7 1*; P10 1*; P11 1*

### Notes on the sheet
- Title
- Date:
- RE:
- Arturo di Girolamo
- Size:
- A3
- A

### Library data of the parts
P4-P11 P22-P27 = MH-M3

## Sheet ina.SchDoc: INA STAGE
size A4; Organization: Altium Limited; Address1: L3, 12a Rodborough Rd; Address2: Frenchs Forest; Address3: NSW; Address4: Australia 2086; DocumentNumber: 1; Revision: 1
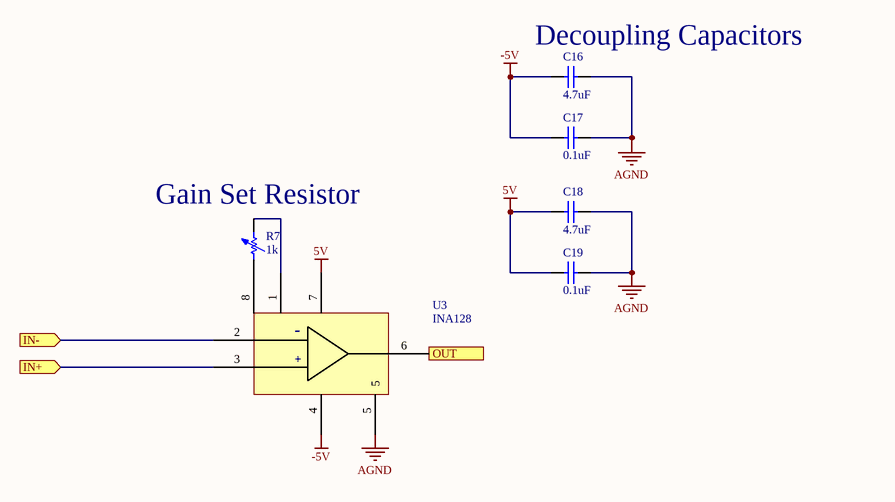
[diagram p9: ina.SchDoc]

### Parts
C16  4.7uF  [0402_Cap]
C17  0.1uF  [0402_Cap]
C18  4.7uF  [0402_Cap]
C19  0.1uF  [0402_Cap]
R7  1k  [TRIMRES]
U3  INA128  [SOIC_8]

### Ports
IN+ (in), IN- (in), OUT (out)

### Nets
5V: C18.1 C19.1 U3.7
-5V: C16.1 C17.1 U3.4
AGND: C16.2 C17.2 C18.2 C19.2 U3.5
NetC28_HP_1: U3.6 ; port OUT
NetC50_1: U3.2 ; port IN-
NetC50_2: U3.3 ; port IN+
NetR7_1: R7.1 U3.8(Gain)
NetR7_2: R7.2 U3.1(Gain)

### Notes on the sheet
- (near C16) Decoupling Capacitors
- (near R7) Gain Set Resistor
- Title
- Date:
- RE:
- Arturo di Girolamo
- Size:
- A3
- A
- (in symbol INA128UA/2K5) -; +

### Library data of the parts
C16 C18 = CL21A475KAQNNNE: as C42 on sheet buffer; MFGPN: CL21A475KAQNNNE
C17 C19 = CL21B104KACNNNC: as C1 on sheet mcu; MFGPN: CL21B104KACNNNC
R7 = PV36W102C01B00_RES: Variable resistor 1k; MFGPN: PV36W102C01B00
U3 = INA128UA/2K5: Instrumentation Amp, Generic; ASYPN: INA828IDR; MFGPN: INA128UA/2K5

## Sheet high_pass.SchDoc: HIGH PASS
size A4; Organization: Altium Limited; Address1: L3, 12a Rodborough Rd; Address2: Frenchs Forest; Address3: NSW; Address4: Australia 2086; DocumentNumber: 1; Revision: 1
Used 2 times, as channels HP, HP2. Parts and nets are listed once, with the designators drawn on the sheet.
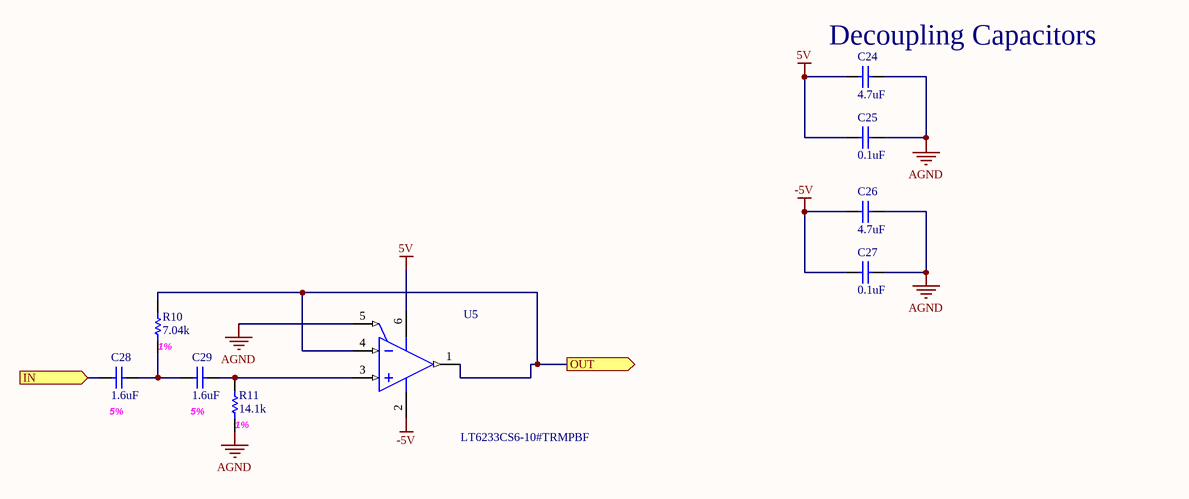
[diagram p10: high_pass.SchDoc]

### Parts
C24  4.7uF  [0402_Cap]
C25  0.1uF  [0402_Cap]
C26  4.7uF  [0402_Cap]
C27  0.1uF  [0402_Cap]
C28  1.6uF  [0402_Cap]
C29  1.6uF  [0402_Cap]
R10  7.04k  [0402_Res]
R11  14.1k  [0402_Res]
U5  LT6233CS6-10#TRMPBF  [LT-S6-6-TSOT-23_N]

### Ports
IN (in), OUT (out)

### Nets
5V: C24.1 C25.1 U5.6(V+)
-5V: C26.1 C27.1 U5.2(V-)
AGND: C24.2 C25.2 C26.2 C27.2 R11.1 U5.5(~{ENABLE})
IN: C28.1 ; port IN
OUT: R10.2 U5.1(OUT) U5.4(-IN) ; port OUT
NetC28_2: C28.2 C29.1 R10.1
NetC29_2: C29.2 R11.2 U5.3(+IN)

### Channels
HP: designators end in _HP; ports IN=NetC28_HP_1 OUT=NetR10_HP_2
HP2: designators end in _HP2; ports IN=NetC28_HP2_1 OUT=NetR10_HP2_2

### Notes on the sheet
- (near C24) Decoupling Capacitors
- (near R10) 1%
- (near C28) 5%
- 5%
- (near R11) 1%
- Title
- Date:
- RE:
- Arturo di Girolamo
- Size:
- A3
- A

### Library data of the parts
C24 C26 = CL21A475KAQNNNE: as C42 on sheet buffer; MFGPN: CL21A475KAQNNNE
C25 C27 = CL21B104KACNNNC: as C1 on sheet mcu; MFGPN: CL21B104KACNNNC
C28 C29 = GRM219R71C564KA01D: Capacitor, 560nF, 0805, 25V; ASYPN: C1005X7S0J155K050BC; Value: 560nF; MFGPN: GRM219R71C564KA01D
  C28: Parameter 1: *
R10 = ERJ-PB6D7501V: 7.5K 1% 1/4W; Value: 1K; ASYPN: RN73R1ETTP7061B25; MFGPN: ERJ-PB6D7501V
R11 = RC0805FR-0714K7L: 14.7K 1% 1/4W; Value: 1K; ASYPN: ERJ-2RKF1402X; MFGPN: RC0805FR-0714K7L
U5 = CMP-0359-02439-2: Single Channel, Ultralow Noise, Low Power, High Speed Operational Amplifier, 375 MHz Typical GBW, 80 V/us Typical SR, 3 to 12.6 V, 6-Pin SOT23 (S6-6), Commercial, Pb-Free, Mini Reel; Linear Technology Part Number: LT6233; Manufacturer: Linear Technology; Vs Max (V): 12.6; Vos (mV) Guaranteed: 0.5; Vos (mV) Typical: 0.1; Channels (#): 1; Vs Min (V): 3; GBW (MHz) Typical: 60; SR (V/us) Typical: 15; Is (mA) Typical: 1.15; ComponentLink3Description: Package Specification; Type: VFB; Mounting Technology: Surface Mount; PackageDescription: 6-Pin Plastic TSOT-23, Body 2.9 x 1.63 mm, Pitch 0.95 mm; ComponentLink2URL: http://cds.linear.com/docs/en/datasheet/623345fc.pdf; ComponentLink1URL: http://www.linear.com/; Packing: Mini Reel; ComponentLink1Description: Manufacturer URL; PartNumber: LT6233CS6-10#TRMPBF; ComponentLink3URL: http://cds.linear.com/docs/en/packaging/SOT_6_05-08-1636.pdf; DatasheetVersion: Rev. C; Code_JEDEC: MO-193; RevisionNote: URLs updated; RoHS: Pb-Free; PackageReference: LT-S6-6-TSOT-23; ComponentLink2Description: Datasheet; ASYPN: LT6233CS6-10#TRMPBF

## Sheet mixer.SchDoc: AD630 Mixer
size A4; Organization: Altium Limited; Address1: L3, 12a Rodborough Rd; Address2: Frenchs Forest; Address3: NSW; Address4: Australia 2086
Used 2 times, as channels MIXER1, MIXER2. Parts and nets are listed once, with the designators drawn on the sheet.
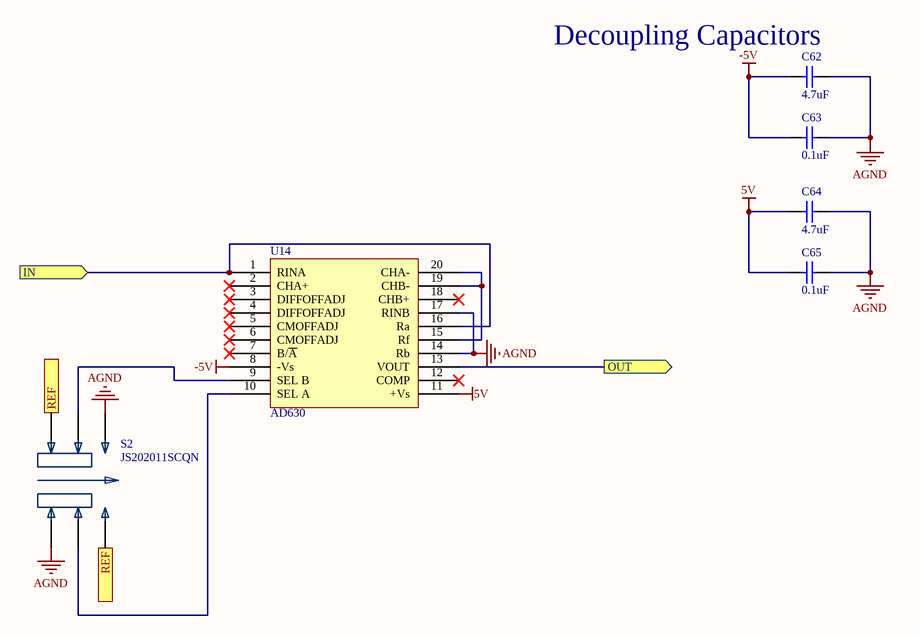
[diagram p11: mixer.SchDoc]

### Parts
C62  4.7uF  [0402_Cap]
C63  0.1uF  [0402_Cap]
C64  4.7uF  [0402_Cap]
C65  0.1uF  [0402_Cap]
S2  JS202011SCQN  [SW_JS202011SCQN]
U14  AD630  [SOIC_20]

### Ports
IN (in), OUT (out), REF (in)

### Nets
5V: C64.1 C65.1 U14.11(+Vs)
-5V: C62.1 C63.1 U14.8(-Vs)
AGND: C62.2 C63.2 C64.2 C65.2 S2.1 S2.6 U14.14(Rb) U14.17(RINB)
IN: U14.1(RINA) U14.16(Ra) ; port IN
OUT: U14.13(VOUT) ; port OUT
REF: S2.3 S2.4 ; port REF
NetS2_2: S2.2 U14.10(SEL_A)
NetS2_5: S2.5 U14.9(SEL_B)
NetU14_15: U14.15(Rf) U14.19(CHB-) U14.20(CHA-)

Not connected (* = marked no-connect by the designer): U14 2(CHA+)* 3(DIFFOFFADJ)* 4(DIFFOFFADJ)* 5(CMOFFADJ)* 6(CMOFFADJ)* 7(B/~{A})* 12(COMP)* 18(CHB+)*

### Channels
MIXER1: designators end in _MIXER1; ports IN=NetR10_HP_2 OUT=NetC28_HP2_1 REF=NetC117_LO1_LPF_2
MIXER2: designators end in _MIXER2; ports IN=NetR2_1 OUT=NetR2_2 REF=NetC123_2

### Notes on the sheet
- (near C62) Decoupling Capacitors
- Title
- Date:
- RE:
- Arturo di Girolamo
- Size:
- A3
- A

### Library data of the parts
C62 C64 = CL21A475KAQNNNE: as C42 on sheet buffer; MFGPN: CL21A475KAQNNNE
C63 C65 = CL21B104KACNNNC: as C1 on sheet mcu; MFGPN: CL21B104KACNNNC
S2 = JS202011SCQN: Slide Switch DPDT Surface Mount; MF: C&K; MFGPN: JS202011SCQN; Value: *; Package: None; SnapEDA_Link: https://www.snapeda.com/parts/JS202011SCQN/C%26K/view-part/592122/?ref=snap; Digi-Key_Part_Number: 401-2002-1-ND; Digi-Key_Purchase_URL: https://www.digikey.com/product-detail/en/c-k/JS202011SCQN/401-2002-1-ND/1640098?utm_source=snapeda&utm_medium=aggregator&utm_campaign=symbol; ASYPN: JS202011SCQN
U14 = AD630ARZ: RF MOD/DEMOD; ASYPN: AD630ARZ

## Sheet amp.SchDoc: Signal Path AMP
size A4; Organization: Altium Limited; Address1: L3, 12a Rodborough Rd; Address2: Frenchs Forest; Address3: NSW; Address4: Australia 2086
Used 2 times, as channels AMP1, AMP2. Parts and nets are listed once, with the designators drawn on the sheet.
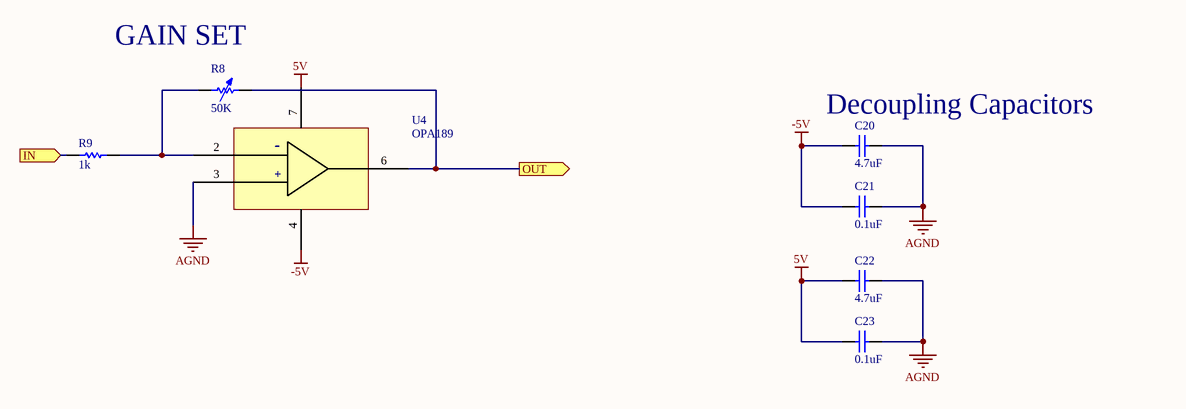
[diagram p12: amp.SchDoc]

### Parts
C20  4.7uF  [0402_Cap]
C21  0.1uF  [0402_Cap]
C22  4.7uF  [0402_Cap]
C23  0.1uF  [0402_Cap]
R8  50K  [TRIMRES]
R9  1k  [0402_Res]
U4  OPA189  [SOIC_8]

### Ports
IN (in), OUT (out)

### Nets
5V: C22.1 C23.1 U4.7
-5V: C20.1 C21.1 U4.4
AGND: C20.2 C21.2 C22.2 C23.2 U4.3
IN: R9.1 ; port IN
OUT: R8.2 U4.6 ; port OUT
NetR8_1: R8.1 R9.2 U4.2

### Channels
AMP1: designators end in _AMP1; ports IN=NetC38_2 OUT=NetR2_1
AMP2: designators end in _AMP2; ports IN=NetR3_2 OUT=NetR1_1

### Notes on the sheet
- (near R8) GAIN SET
- (near C20) Decoupling Capacitors
- Title
- Date:
- RE:
- Arturo di Girolamo
- Size:
- A3
- A
- (in symbol OPA189IDR) -; +

### Library data of the parts
C20 C22 = CL21A475KAQNNNE: as C42 on sheet buffer; MFGPN: CL21A475KAQNNNE
C21 C23 = CL21B104KACNNNC: as C1 on sheet mcu; MFGPN: CL21B104KACNNNC
R8 = 3296W-1-103LF: Variable Resistor; MFGPN: 3296W-1-103LF
R9 = RNCP0805FTD1K00: 1K 1% 1/4W; ASYPN: RMCF0402FT1K00; Value: 1K; MFGPN: RNCP0805FTD1K00
U4 = OPA189IDR: Precision OpAmp, Generic; MFGPN: OPA189IDR; ASYPN: OPA189ID

## Sheet dcshift.SchDoc: Signal Path DC Shift
size A4; Organization: Altium Limited; Address1: L3, 12a Rodborough Rd; Address2: Frenchs Forest; Address3: NSW; Address4: Australia 2086
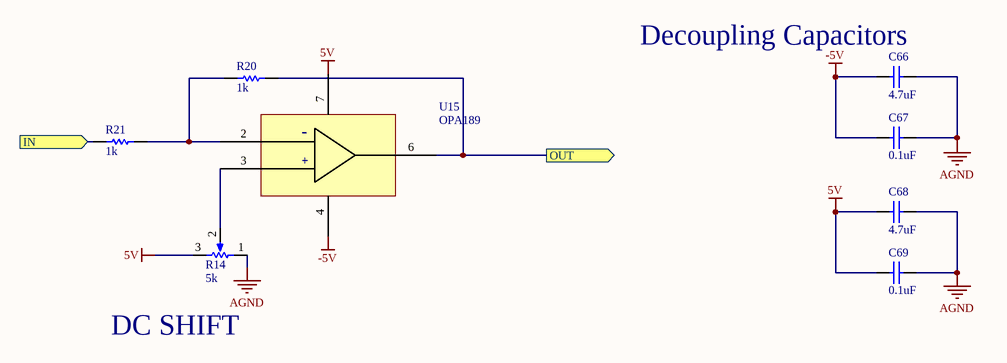
[diagram p13: dcshift.SchDoc]

### Parts
C66  4.7uF  [0402_Cap]
C67  0.1uF  [0402_Cap]
C68  4.7uF  [0402_Cap]
C69  0.1uF  [0402_Cap]
R14  5k  [TRIMPOT]
R20  1k  [0402_Res]
R21  1k  [0402_Res]
U15  OPA189  [SOIC_8]

### Ports
IN (in), OUT (out)

### Nets
5V: C68.1 C69.1 R14.3(BOT) U15.7
-5V: C66.1 C67.1 U15.4
AGND: C66.2 C67.2 C68.2 C69.2 R14.1(TOP)
NetR2_2: R21.1 ; port IN
NetR3_2: R20.2 U15.6 ; port OUT
NetR14_2: R14.2(TAP) U15.3
NetR20_1: R20.1 R21.2 U15.2

### Notes on the sheet
- (near C66) Decoupling Capacitors
- DC SHIFT
- Title
- Date:
- RE:
- Arturo di Girolamo
- Size:
- A3
- A
- (in symbol OPA189IDR) -; +

### Library data of the parts
C66 C68 = CL21A475KAQNNNE: as C42 on sheet buffer; MFGPN: CL21A475KAQNNNE
C67 C69 = CL21B104KACNNNC: as C1 on sheet mcu; MFGPN: CL21B104KACNNNC
R14 = PV36W102C01B00: Potentiometer, 1k; MFGPN: PV36W102C01B00
R20 R21 = RNCP0805FTD1K00: 1K 1% 1/4W; ASYPN: RMCF0402FT1K00; Value: 1K; MFGPN: RNCP0805FTD1K00
U15 = OPA189IDR: Precision OpAmp, Generic; MFGPN: OPA189IDR; ASYPN: OPA189ID

## Sheet LPF_ADC.SchDoc: ADC LPF
size A4; Organization: Altium Limited; Address1: L3, 12a Rodborough Rd; Address2: Frenchs Forest; Address3: NSW; Address4: Australia 2086
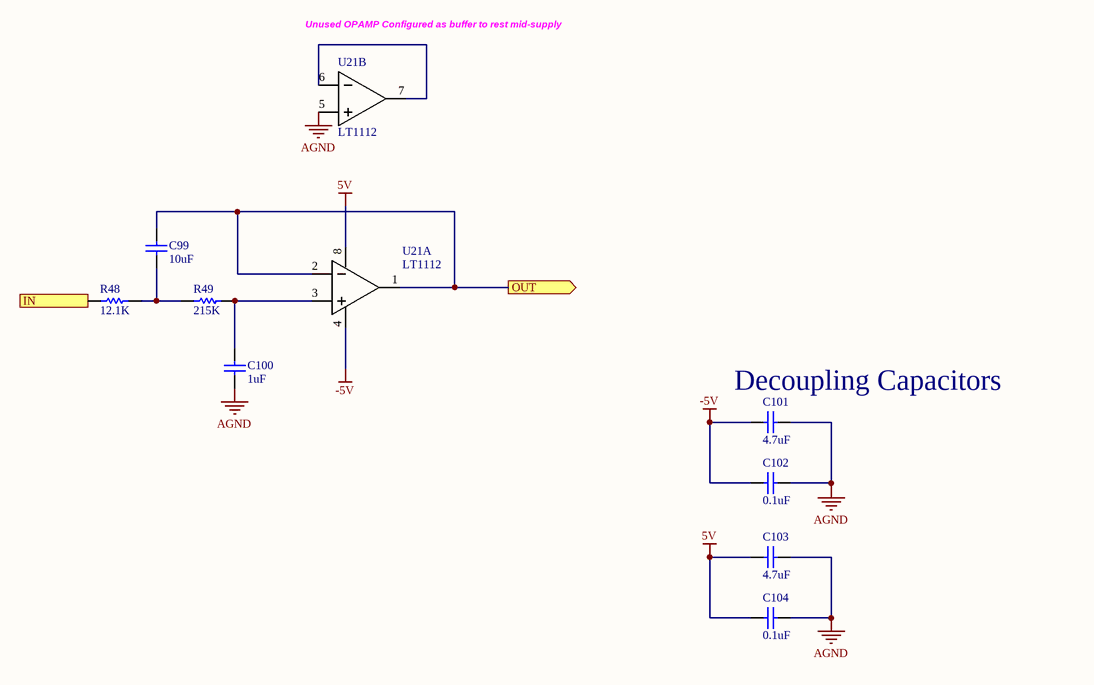
[diagram p14: LPF_ADC.SchDoc]

### Parts
C99  10uF  [0402_Cap]
C100  1uF  [0402_Cap]
C101  4.7uF  [0402_Cap]
C102  0.1uF  [0402_Cap]
C103  4.7uF  [0402_Cap]
C104  0.1uF  [0402_Cap]
R48  12.1K  [0402_Res]
R49  215K  [0402_Res]
U21  LT1112  [SOIC_8]  (parts A,B of 2)

### Ports
IN (in), OUT (out)

### Nets
5V: C103.1 C104.1 U21.8
-5V: C101.1 C102.1 U21.4
AGND: C100.1 C101.2 C102.2 C103.2 C104.2 U21.5
NetC99_1: C99.1 R48.2 R49.1
NetC99_2: C99.2 U21.1 U21.2 ; port OUT
NetC100_2: C100.2 R49.2 U21.3
NetR1_1: R48.1 ; port IN
NetU21_6: U21.6 U21.7

### Notes on the sheet
- Unused OPAMP Configured as buffer to rest mid-supply
- (near C101) Decoupling Capacitors
- Title
- Date:
- RE:
- Arturo di Girolamo
- Size:
- A3
- A

### Library data of the parts
C99 = 08051C163JAT2A: Capacitor, 16nF, 0805, 25V; ASYPN: CL05A106MQ5NUNC; Value: 16nF; MFGPN: 08051C163JAT2A
C100 = GRM2165C2A162JA01D: Capacitor, 1.6nF, 0805, 25V; ASYPN: CL05A105KQ5NNNC; Value: 1.6nF; MFGPN: GRM2165C2A162JA01D
C101 C103 = CL21A475KAQNNNE: as C42 on sheet buffer; MFGPN: CL21A475KAQNNNE
C102 C104 = CL21B104KACNNNC: as C1 on sheet mcu; MFGPN: CL21B104KACNNNC
R48 = RC0805FR-071K65L: 1.65k; ASYPN: RMCF0402FT12K1; Value: 1.65k; MFGPN: RC0805FR-071K65L
R49 = RC0805FR-075K9L: 5.9k; ASYPN: ERJ-2RKF2153X; Value: 5.9k; MFGPN: RC0805FR-075K9L
U21 = LT1112: ASYPN: LT1112IS8#PBF

## Sheet LO.SchDoc: DDS
size A4; Organization: Altium Limited; Address1: L3, 12a Rodborough Rd; Address2: Frenchs Forest; Address3: NSW; Address4: Australia 2086
Used 2 times, as channels LO1, LO2. Parts and nets are listed once, with the designators drawn on the sheet.
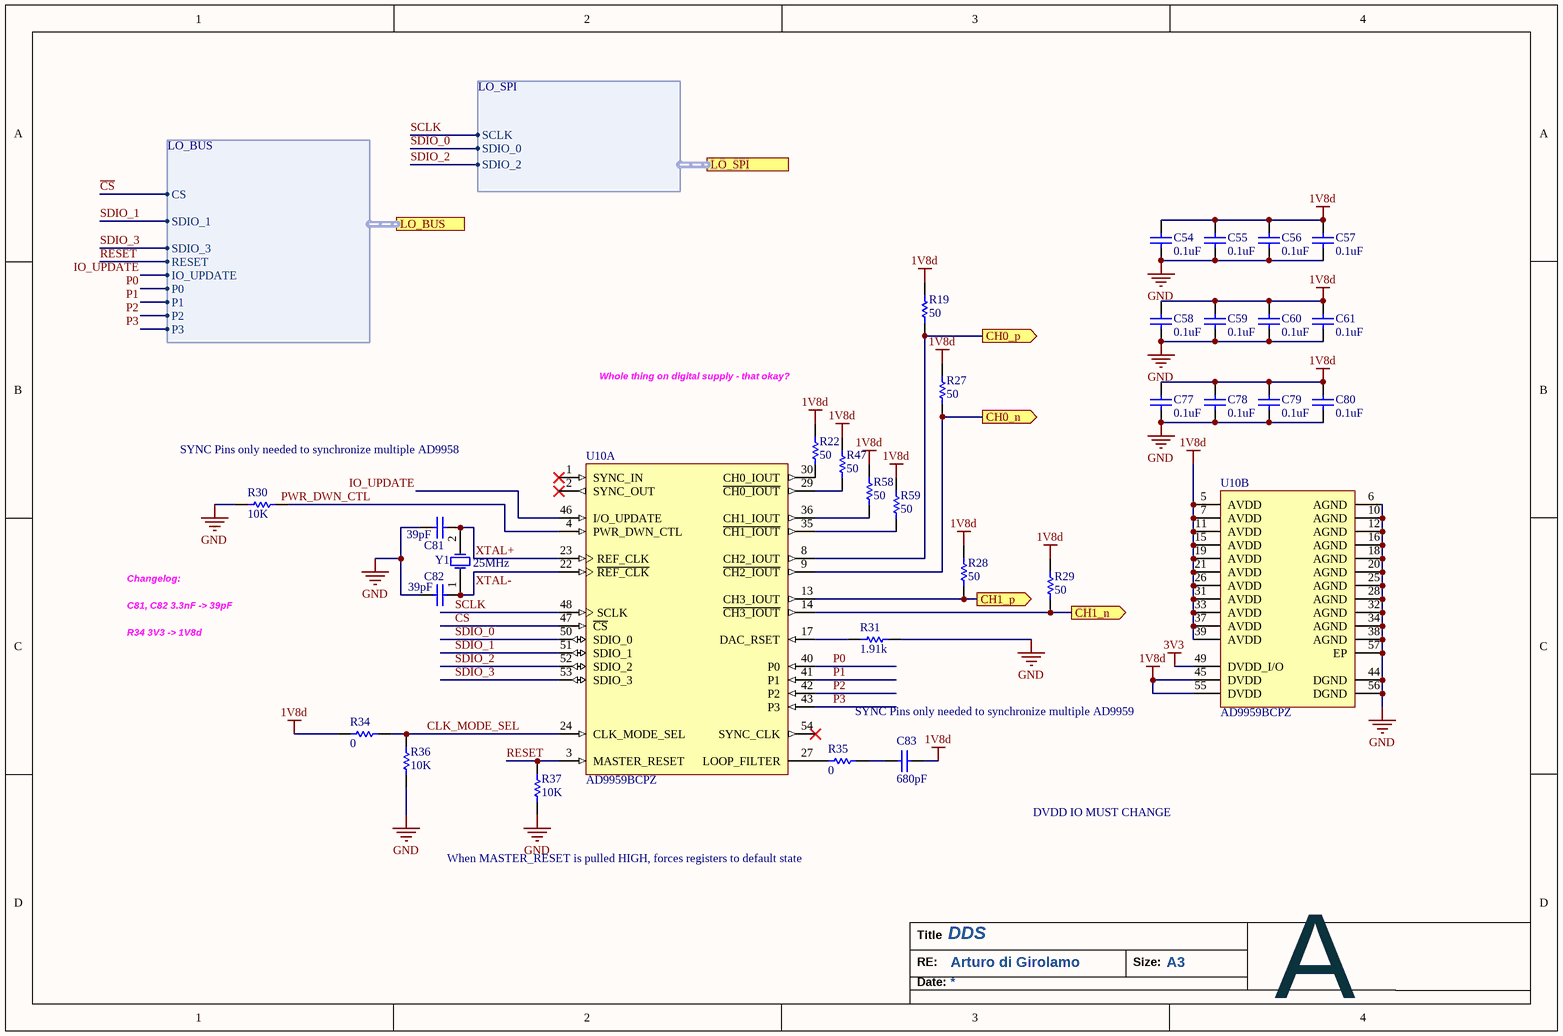
[diagram p15: LO.SchDoc]

### Parts
C54  0.1uF  [0402_Cap]
C55  0.1uF  [0402_Cap]
C56  0.1uF  [0402_Cap]
C57  0.1uF  [0402_Cap]
C58  0.1uF  [0402_Cap]
C59  0.1uF  [0402_Cap]
C60  0.1uF  [0402_Cap]
C61  0.1uF  [0402_Cap]
C77  0.1uF  [0402_Cap]
C78  0.1uF  [0402_Cap]
C79  0.1uF  [0402_Cap]
C80  0.1uF  [0402_Cap]
C81  39pF  [0402_Cap]
C82  39pF  [0402_Cap]
C83  680pF  [0402_Cap]
R19  50  [0402_Res]
R22  50  [0402_Res]
R27  50  [0402_Res]
R28  50  [0402_Res]
R29  50  [0402_Res]
R30  10K  [0402_Res]
R31  1.91k  [0402_Res]
R34  0  [0402_Res]
R35  0  [0402_Res]
R36  10K  [0402_Res]
R37  10K  [0402_Res]
R47  50  [0402_Res]
R58  50  [0402_Res]
R59  50  [0402_Res]
U10  AD9959BCPZ  [ADI-CP-56-1_M]  (parts A,B of 2)
Y1  25MHz  [XTAL_ECS-160-20-4X]

### Ports
CH0_n (out), CH0_p (out), CH1_n (out), CH1_p (out), LO_BUS (harness LO_BUS), LO_SPI (harness LO_SPI)

### Harnesses
LO_BUS: P2, P1, P0, IO_UPDATE, RESET, SDIO_3, SDIO_1, CS, P3
LO_SPI: SDIO_2, SDIO_0, SCLK

### Nets
1V8d: C54.2 C55.2 C56.2 C57.2 C58.2 C59.2 C60.2 C61.2 C77.2 C78.2 C79.2 C80.2 C83.2 R19.2 R22.2 R27.2 R28.2 R29.2 R34.1 R47.2 R58.2 R59.2 U10.5(AVDD) U10.7(AVDD) U10.11(AVDD) U10.15(AVDD) U10.19(AVDD) U10.21(AVDD) U10.26(AVDD) U10.31(AVDD) U10.33(AVDD) U10.37(AVDD) U10.39(AVDD) U10.45(DVDD) U10.55(DVDD)
3V3: U10.49(DVDD_I/O)
GND: C54.1 C55.1 C56.1 C57.1 C58.1 C59.1 C60.1 C61.1 C77.1 C78.1 C79.1 C80.1 C81.2 C82.2 R30.1 R31.2 R36.1 R37.1 U10.6(AGND) U10.10(AGND) U10.12(AGND) U10.16(AGND) U10.18(AGND) U10.20(AGND) U10.25(AGND) U10.28(AGND) U10.32(AGND) U10.34(AGND) U10.38(AGND) U10.44(DGND) U10.56(DGND) U10.57(EP)
~{CS}: U10.47(~{CS}) ; port LO_BUS.CS
CH0_n: R27.1 U10.9(~{CH2_IOUT}) ; port CH0_n
CH0_p: R19.1 U10.8(CH2_IOUT) ; port CH0_p
CH1_n: R29.1 U10.14(~{CH3_IOUT}) ; port CH1_n
CH1_p: R28.1 U10.13(CH3_IOUT) ; port CH1_p
CLK_MODE_SEL: R34.2 R36.2 U10.24(CLK_MODE_SEL)
IO_UPDATE: U10.46(I/O_UPDATE) ; port LO_BUS.IO_UPDATE
P0: U10.40(P0) ; port LO_BUS.P0
P1: U10.41(P1) ; port LO_BUS.P1
P2: U10.42(P2) ; port LO_BUS.P2
P3: U10.43(P3) ; port LO_BUS.P3
RESET: R37.2 U10.3(MASTER_RESET) ; port LO_BUS.RESET
SCLK: U10.48(SCLK) ; port LO_SPI.SCLK
SDIO_0: U10.50(SDIO_0) ; port LO_SPI.SDIO_0
SDIO_1: U10.51(SDIO_1) ; port LO_BUS.SDIO_1
SDIO_2: U10.52(SDIO_2) ; port LO_SPI.SDIO_2
SDIO_3: U10.53(SDIO_3) ; port LO_BUS.SDIO_3
XTAL+: C81.1 U10.23(REF_CLK) Y1.2(OSC2)
XTAL-: C82.1 U10.22(~{REF_CLK}) Y1.1(OSC1)
NetC83_1: C83.1 R35.2
NetR22_1: R22.1 U10.30(CH0_IOUT)
NetR30_2: R30.2 U10.4(PWR_DWN_CTL)
NetR31_1: R31.1 U10.17(DAC_RSET)
NetR35_1: R35.1 U10.27(LOOP_FILTER)
NetR47_1: R47.1 U10.29(~{CH0_IOUT})
NetR58_1: R58.1 U10.36(CH1_IOUT)
NetR59_1: R59.1 U10.35(~{CH1_IOUT})

Not connected (* = marked no-connect by the designer): U10 1(SYNC_IN)* 2(SYNC_OUT)* 54(SYNC_CLK)*

### Channels
LO1: designators end in _LO1; ports CH0_n=NetR27_LO1_1 CH0_p=NetR19_LO1_1 CH1_n=NetR29_LO1_1 CH1_p=NetR28_LO1_1
LO2: designators end in _LO2; ports CH0_n=NetR27_LO2_1 CH0_p=NetR19_LO2_1 CH1_n=NetR29_LO2_1 CH1_p=NetR28_LO2_1

### Notes on the sheet
- Whole thing on digital supply - that okay?
- SYNC Pins only needed to synchronize multiple AD9958
- Changelog:
- C81, C82 3.3nF -> 39pF
- R34 3V3 -> 1V8d
- SYNC Pins only needed to synchronize multiple AD9959
- DVDD IO MUST CHANGE
- (near R37) When MASTER_RESET is pulled HIGH, forces registers to default state
- Labels drawn without touching a wire or pin: PWR_DWN_CTL
- Title
- Date:
- RE:
- Arturo di Girolamo
- Size:
- A3
- A

### Library data of the parts
C54-C61 C77-C80 = CL21B104KACNNNC: as C1 on sheet mcu; MFGPN: CL21B104KACNNNC
C81 C82 = C0805C332KARACAUTO: as C48 on sheet adc; MFGPN: C0805C332KARACAUTO
C83 = GRM21BR61E226ME44L: Capacitor, 22uF, 0805, 25V; Value: .01uf; ASYPN: 885012205005; MFGPN: GRM21BR61E226ME44L
R19 R22 R27-R29 R47 R58 R59 = RMCF0805ZT0R00: 0 ohm jumper; Value: 0; ASYPN: FC0402E50R0BTBT1; MFGPN: RMCF0805ZT0R00
R30 R36 R37 = RNCP0805FTD10K0: 10K 1% 1/4W; Value: 1K; ASYPN: MCS0402MC1002FE000; MFGPN: RNCP0805FTD10K0
R31 = RMCF0805ZT0R00: 0 ohm jumper; Value: 0; ASYPN: RMCF0402FT1K91; MFGPN: RMCF0805ZT0R00
R34 R35 = RMCF0805ZT0R00: 0 ohm jumper; ASYPN: RK73Z1ELTP; Value: 0; MFGPN: RMCF0805ZT0R00
U10 = CMP-0293-00014-1: 4-Channel, 500 MSPS DDS with 10-Bit DACs, Serial, CP-56-1, 260 Tray, Pb-Free; Tuning Word Width (bits): 32bit; Master fclk: 500MHz; Compliance Range (V): 2.3V; FS Iout (mA nom): 10mA; REFCLK Multiplier: Yes; I Supply total (max): 180mA; Resolution (Bits): 10bit; ComponentLink3URL: http://www.analog.com/static/imported-files/packages/32698137492825CP_56_1.pdf; PackageDescription: 56-Lead Lead Frame Chip Scale Package [LFCSP_VQ]; DatasheetVersion: Rev. B; ComponentLink1URL: www.analog.com; PackageVersion: 112805-0; ComponentLink1Description: Manufacturer URL; ComponentLink2Description: Datasheet; Code_JEDEC: MO-220-VLLD-2; ComponentLink2URL: http://www.analog.com/static/imported-files/data_sheets/AD9959.pdf; PackageReference: CP-56-1; I/O Interface: Serial; ComponentLink3Description: Package Specification
Y1 = XTAL: Crystal Oscillator; Published: 8-Jun-2000; LatestRevisionDate: 17-Jul-2002; LatestRevisionNote: Re-released for DXP Platform.; PackageReference: R38; Publisher: Altium Limited; PackageDescription: Crystal, Thru-Hole; 2 Leads; Body 3.1 x 8.2 mm (Dia.xH)